# EAGLE schematic Speed Reg (EAGLE 5.11)

## Sheet 1 of 11
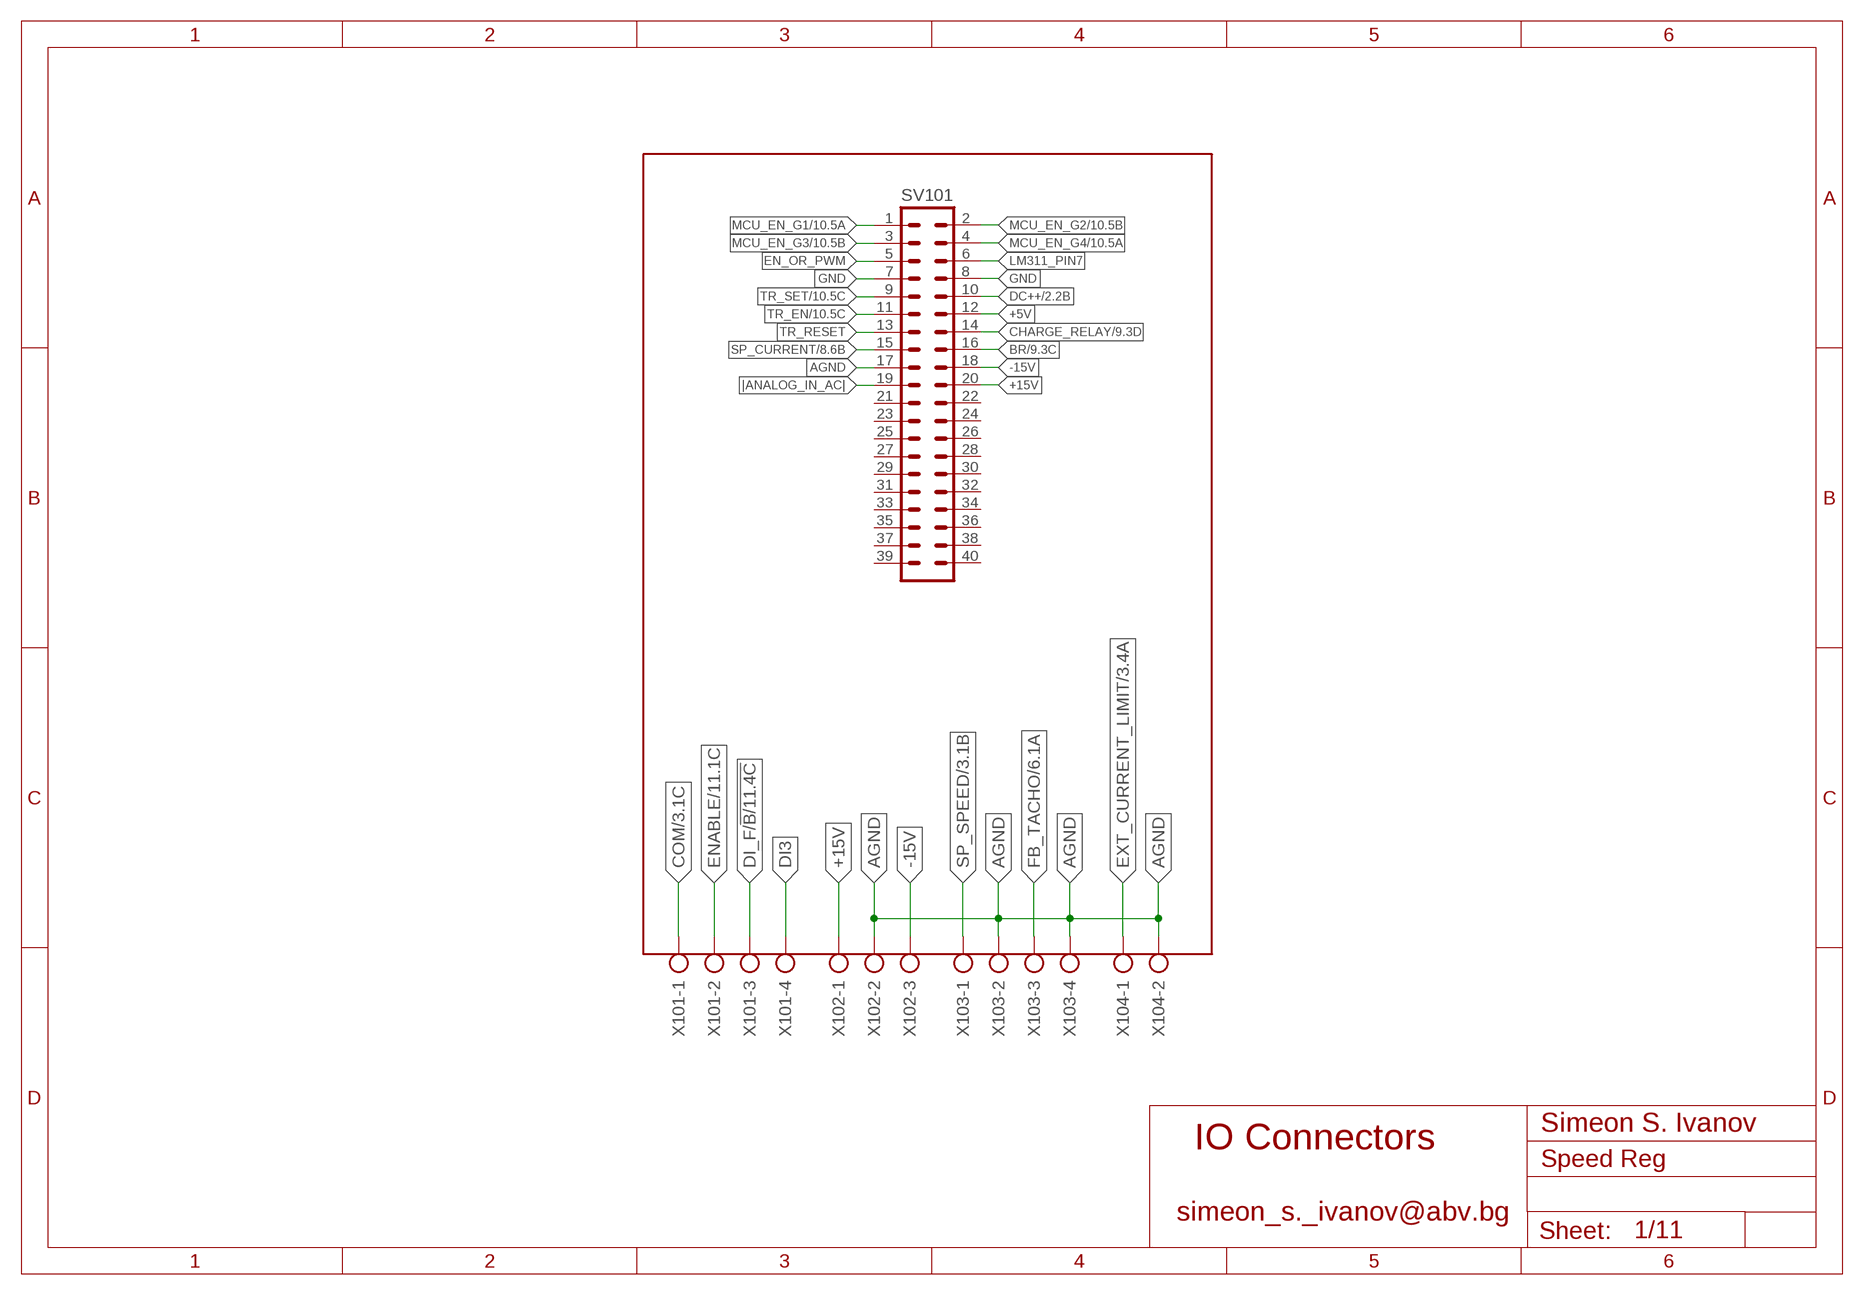
[diagram p0: schematic, sheet 1]

### Parts
SV101  ML40  [ML40]
X101  AK500/4-H  [AK500/4-H]
X102  AK500/3-H  [AK500/3-H]
X103  AK500/4-H  [AK500/4-H]
X104  AK500/2-H  [AK500/2-H]

### Nets
+5V: SV101.12 ; also sheet 2,9,10
+15V: SV101.20 X102.1 ; also sheet 2,3,4,5,6,7,8,9
-15V: SV101.18 X102.3 ; also sheet 2,3,4,5,6,7,8,9
AGND: SV101.17 X102.2 X103.2 X103.4 X104.2 ; also sheet 2,3,4,5,6,7,8,9
BR: SV101.16 ; also sheet 9
CHARGE_RELAY: SV101.14 ; also sheet 9,11
COM: X101.1 ; also sheet 3,11
DC++: SV101.10 ; also sheet 2,9
DI3: X101.4
DI_F/!B: X101.3 ; also sheet 11
EN_OR_PWM: SV101.5
ENABLE: X101.2 ; also sheet 11
EXT_CURRENT_LIMIT: X104.1 ; also sheet 3
FB_TACHO: X103.3 ; also sheet 6
GND: SV101.7 SV101.8 ; also sheet 2,9,10,11
LM311_PIN7: SV101.6
MCU_EN_G1: SV101.1 ; also sheet 10
MCU_EN_G2: SV101.2 ; also sheet 10
MCU_EN_G3: SV101.3 ; also sheet 10
MCU_EN_G4: SV101.4 ; also sheet 10
SP_CURRENT: SV101.15 ; also sheet 8
SP_SPEED: X103.1 ; also sheet 3
TR_EN: SV101.11 ; also sheet 10
TR_RESET: SV101.13
TR_SET: SV101.9 ; also sheet 10
|ANALOG_IN_AC|: SV101.19
Unconnected: SV101.21 SV101.22 SV101.23 SV101.24 SV101.25 SV101.26 SV101.27 SV101.28 SV101.29 SV101.30 SV101.31 SV101.32 SV101.33 SV101.34 SV101.35 SV101.36 SV101.37 SV101.38 SV101.39 SV101.40

### Notes on the sheet
- Simeon S. Ivanov
- IO Connectors
- simeon_s._ivanov@abv.bg

## Sheet 2 of 11
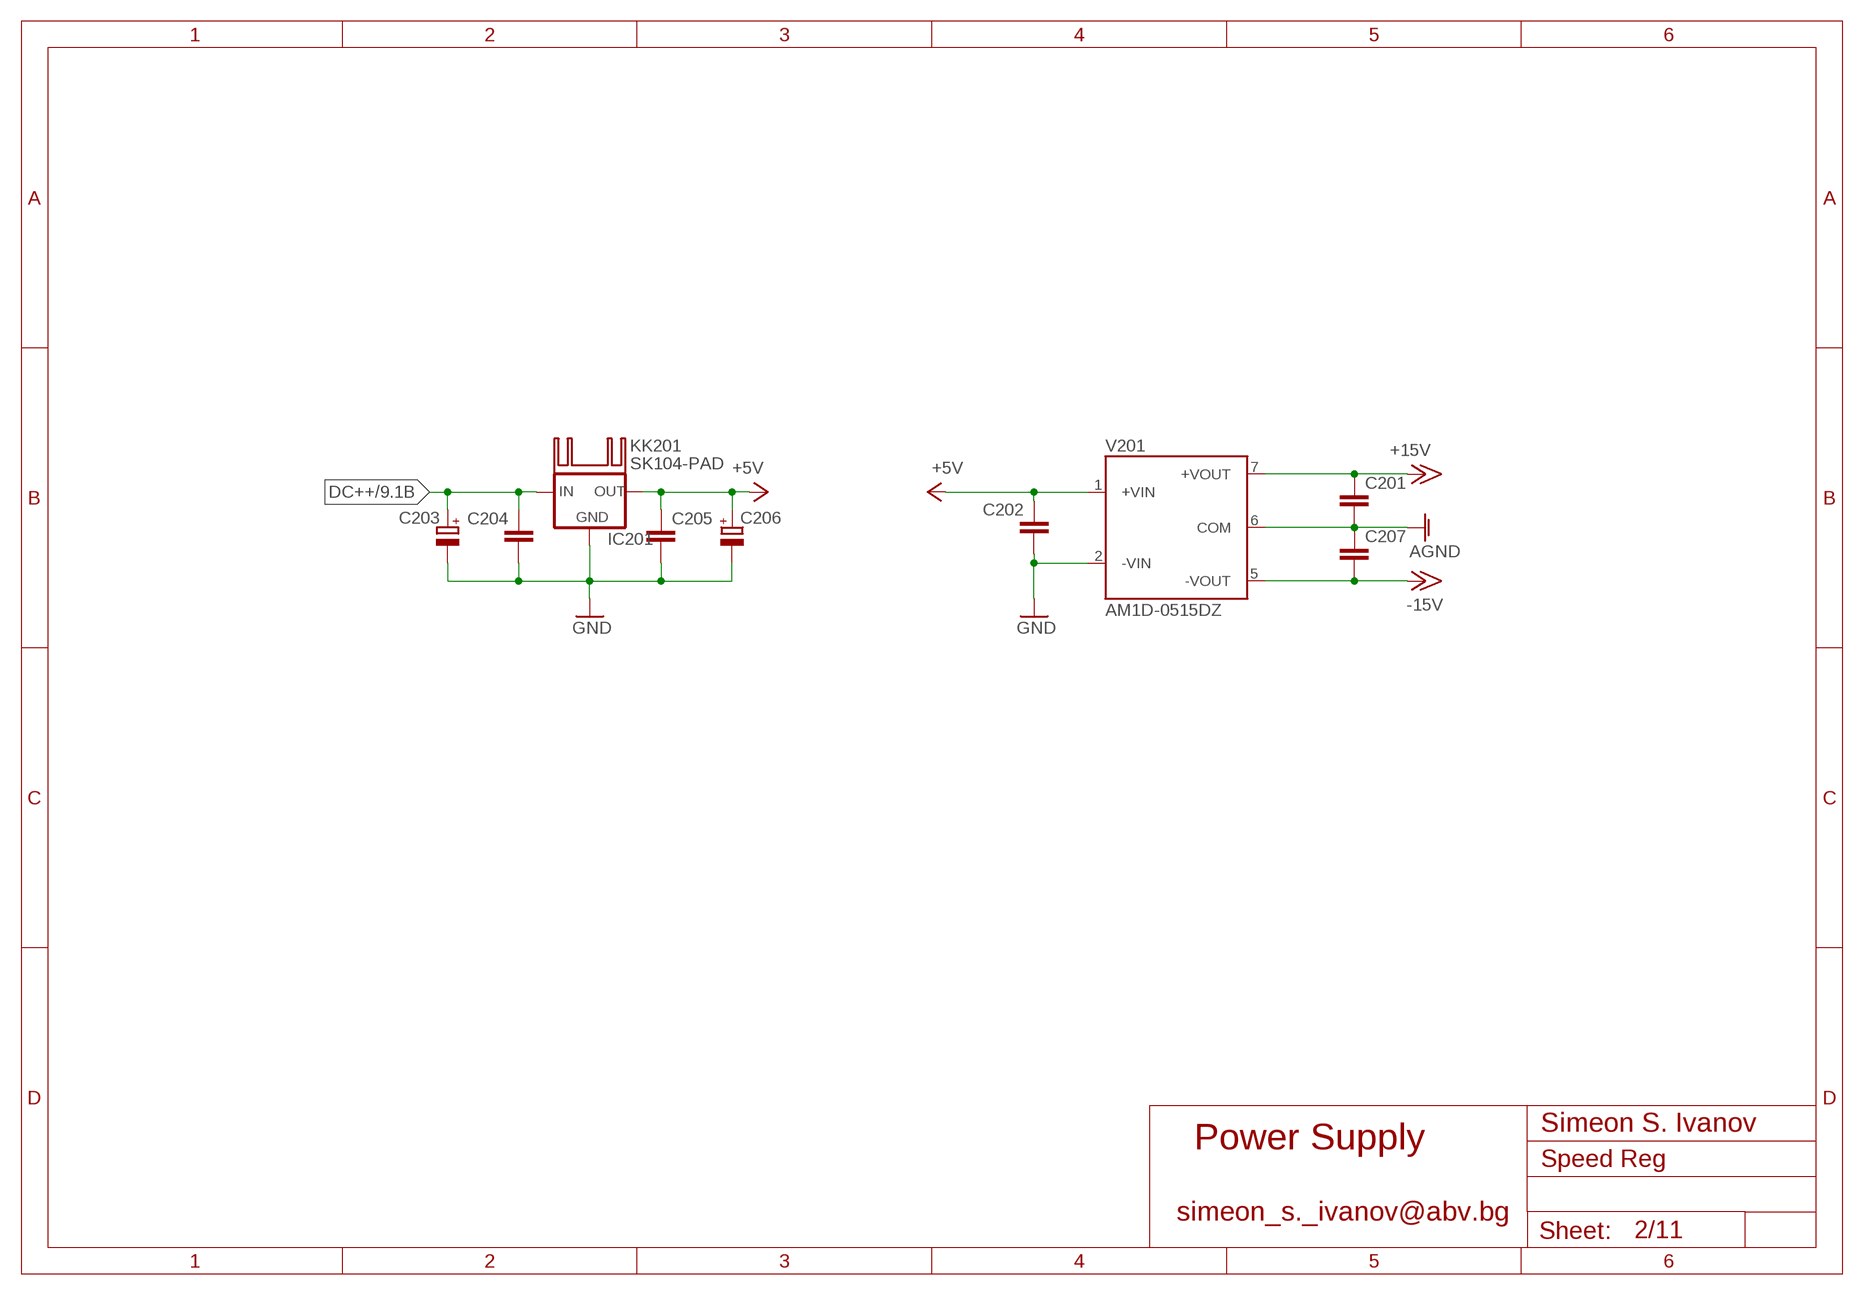
[diagram p1: schematic, sheet 2]

### Parts
C201  C-EUC1206  [C1206]
C202  C-EUC1206  [C1206]
C203  CPOL-EUE2.5-6  [E2,5-6]
C204  C-EUC1206  [C1206]
C205  C-EUC1206  [C1206]
C206  CPOL-EUE2.5-6  [E2,5-6]
C207  C-EUC1206  [C1206]
IC201  78XXS  [78XXS]
KK201  SK104-PAD  [SK104-PAD]
V201  AM1D-0515DZ  TMA0515D  [TMA_DUAL]

### Nets
+5V: C202.1 C205.1 C206.+ IC201.OUT V201.1(+VIN) ; also sheet 1,9,10
+15V: C201.1 V201.7(+VOUT) ; also sheet 1,3,4,5,6,7,8,9
-15V: C207.2 V201.5(-VOUT) ; also sheet 1,3,4,5,6,7,8,9
AGND: C201.2 C207.1 V201.6(COM) ; also sheet 1,3,4,5,6,7,8,9
DC++: C203.+ C204.1 IC201.IN ; also sheet 1,9
GND: C202.2 C203.- C204.2 C205.2 C206.- IC201.GND V201.2(-VIN) ; also sheet 1,9,10,11
Unconnected: KK201.K1(K) KK201.K2(K)

### Notes on the sheet
- Simeon S. Ivanov
- Power Supply
- simeon_s._ivanov@abv.bg

## Sheet 3 of 11
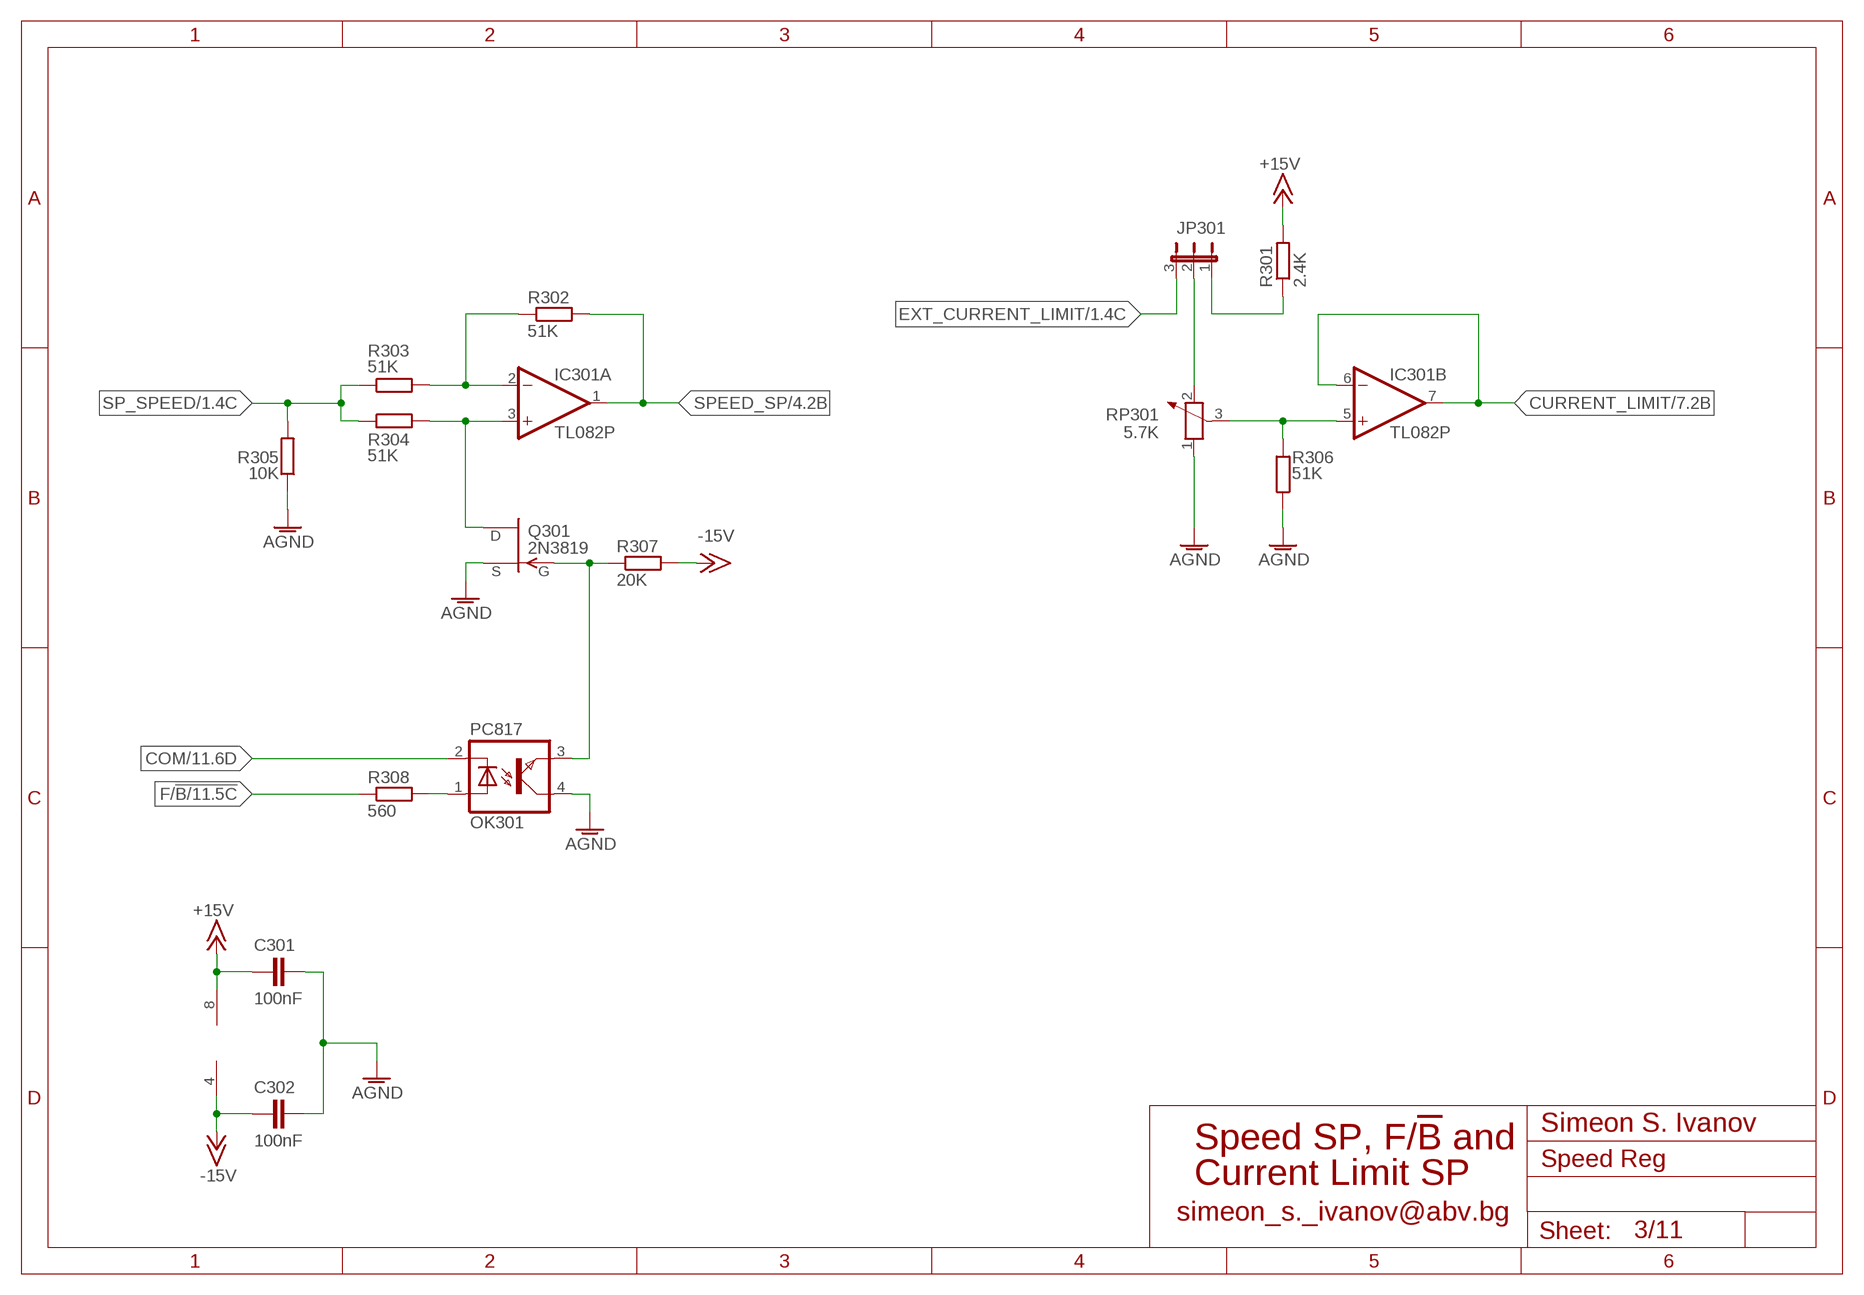
[diagram p2: schematic, sheet 3]

### Parts
C301  100nF  C-EUC0805  [C0805]
C302  100nF  C-EUC0805  [C0805]
IC301  TL082P  [DIL08]
JP301  JP2E  [JP2]
OK301  PC817  [DIL04]
Q301  2N3819  [TO92]
R301  2.4K  R-EU_0207/7  [0207/7]
R302  51K  R-EU_0207/7  [0207/7]
R303  51K  R-EU_0207/7  [0207/7]
R304  51K  R-EU_0207/7  [0207/7]
R305  10K  R-EU_0207/7  [0207/7]
R306  51K  R-EU_0207/7  [0207/7]
R307  20K  R-EU_0207/7  [0207/7]
R308  560  R-EU_0207/7  [0207/7]
RP301  5.7K  POTENTIOMETER_PT-10  [PT-10]

### Nets
+15V: C301.1 IC301.8(P:V+) R301.2 ; also sheet 1,2,4,5,6,7,8,9
-15V: C302.1 IC301.4(P:V-) R307.2 ; also sheet 1,2,4,5,6,7,8,9
AGND: C301.2 C302.2 OK301.4(COL) Q301.3(S) R305.1 R306.1 RP301.1 ; also sheet 1,2,4,5,6,7,8,9
COM: OK301.2(C) ; also sheet 1,11
CURRENT_LIMIT: IC301.6(B:-IN) IC301.7(B:OUT) ; also sheet 7
EXT_CURRENT_LIMIT: JP301.3 ; also sheet 1
F/!B: R308.1 ; also sheet 11
N$10: JP301.2 RP301.2
N$14: OK301.3(EMIT) Q301.2(G) R307.1
N$24: JP301.1 R301.1
N$26: IC301.2(A:-IN) R302.1 R303.2
N$46: IC301.5(B:+IN) R306.2 RP301.3
N$47: OK301.1(A) R308.2
N$49: IC301.3(A:+IN) Q301.1(D) R304.2
SP_SPEED: R303.1 R304.1 R305.2 ; also sheet 1
SPEED_SP: IC301.1(A:OUT) R302.2 ; also sheet 4

### Notes on the sheet
- Simeon S. Ivanov
- Speed SP, F/!B! and
- Current Limit SP
- simeon_s._ivanov@abv.bg

## Sheet 4 of 11
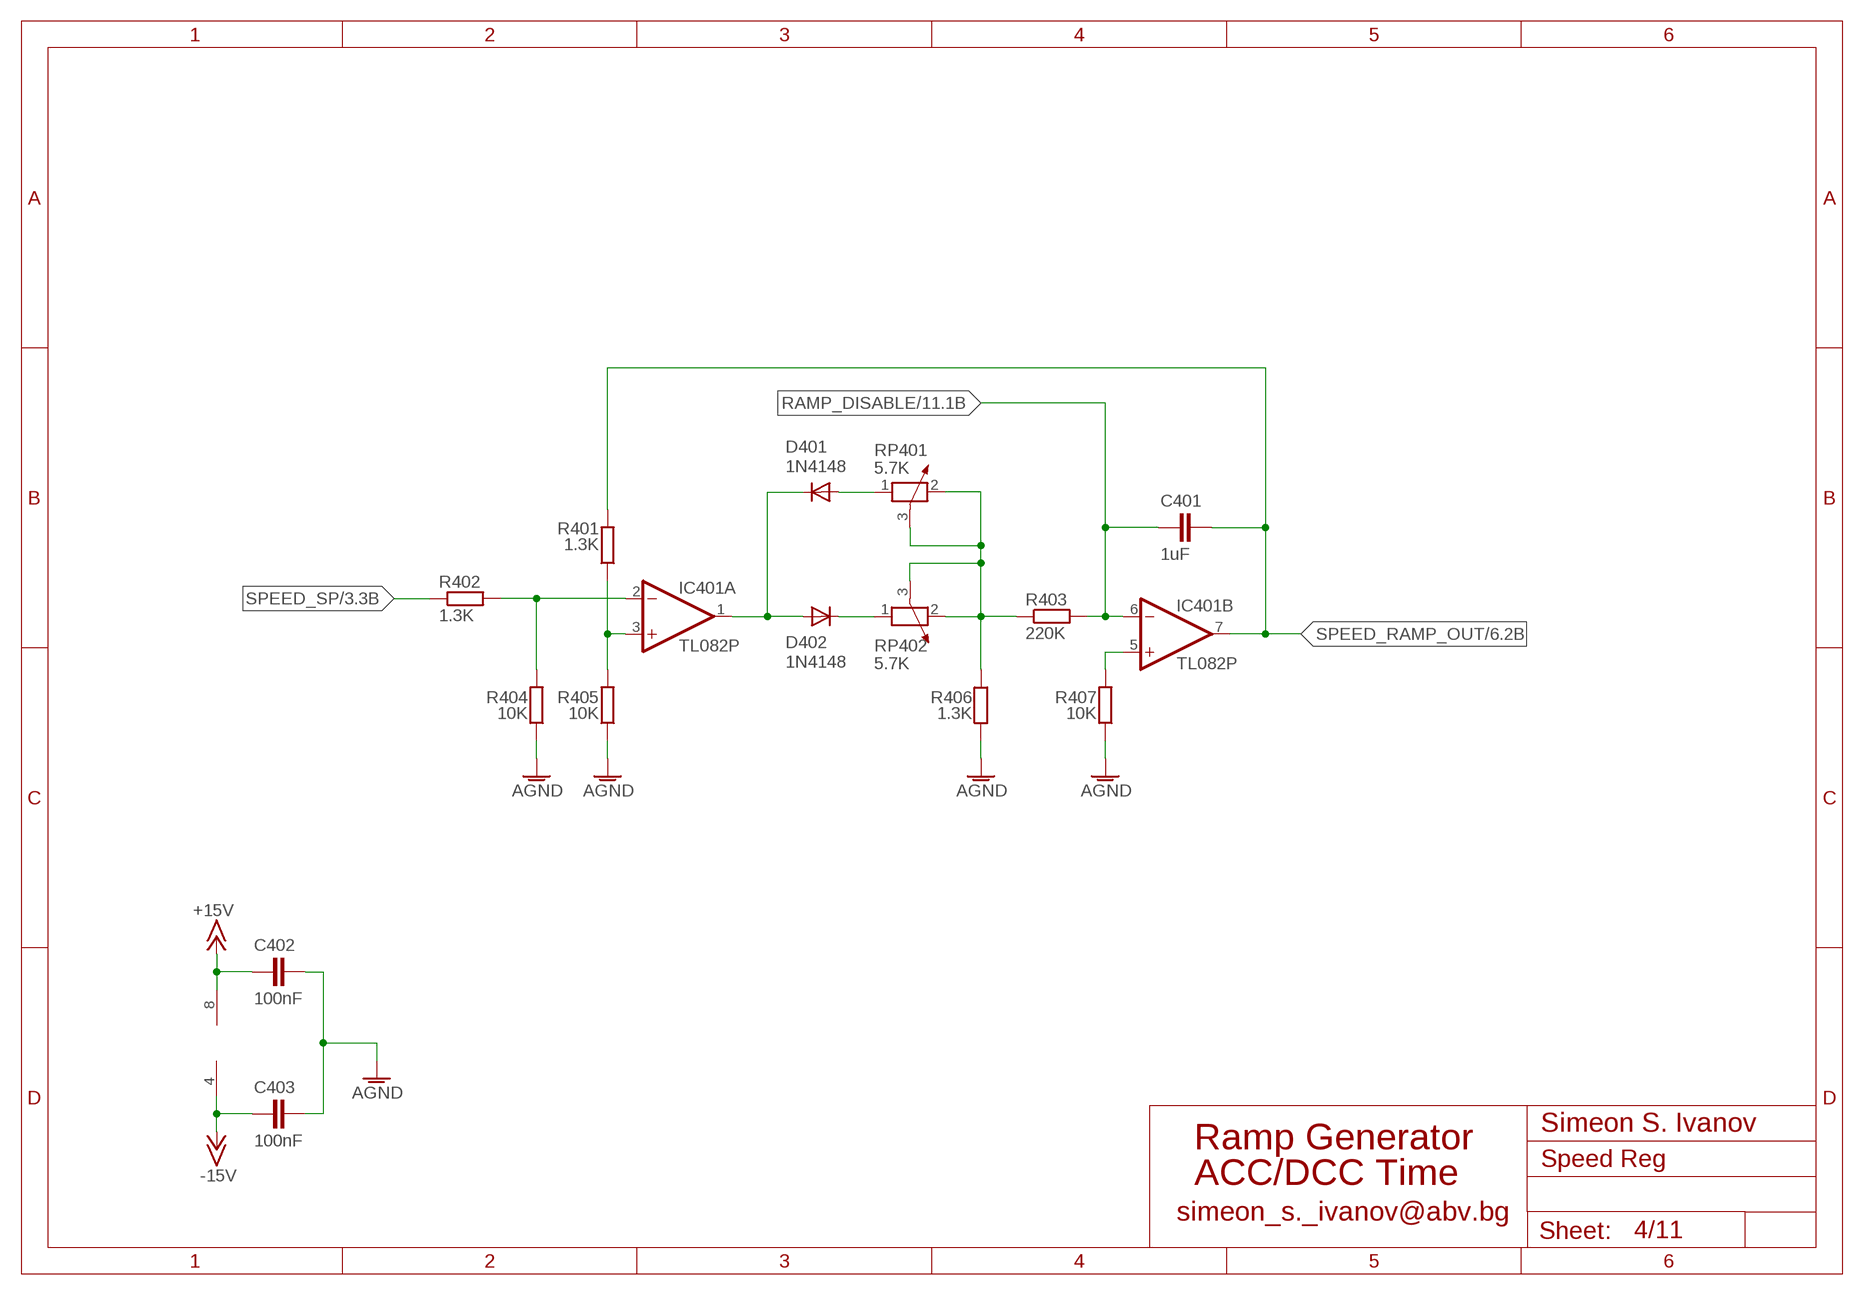
[diagram p3: schematic, sheet 4]

### Parts
C401  1uF  C-EU075-052X106  [C075-052X106]
C402  100nF  C-EUC0805  [C0805]
C403  100nF  C-EUC0805  [C0805]
D401  1N4148  1N4148DO35-10  [DO35-10]
D402  1N4148  1N4148DO35-10  [DO35-10]
IC401  TL082P  [DIL08]
R401  1.3K  R-EU_0207/7  [0207/7]
R402  1.3K  R-EU_0207/7  [0207/7]
R403  220K  R-EU_0207/7  [0207/7]
R404  10K  R-EU_0207/7  [0207/7]
R405  10K  R-EU_0207/7  [0207/7]
R406  1.3K  R-EU_0207/7  [0207/7]
R407  10K  R-EU_M0805  [M0805]
RP401  5.7K  POTENTIOMETER_PT-10  [PT-10]
RP402  5.7K  POTENTIOMETER_PT-10  [PT-10]

### Nets
+15V: C402.1 IC401.8(P:V+) ; also sheet 1,2,3,5,6,7,8,9
-15V: C403.1 IC401.4(P:V-) ; also sheet 1,2,3,5,6,7,8,9
AGND: C402.2 C403.2 R404.1 R405.1 R406.1 R407.1 ; also sheet 1,2,3,5,6,7,8,9
N$6: R403.1 R406.2 RP401.2 RP401.3 RP402.2 RP402.3
N$7: D402.C RP402.1
N$8: D401.A RP401.1
N$9: D401.C D402.A IC401.1(A:OUT)
N$11: IC401.3(A:+IN) R401.1 R405.2
N$12: IC401.2(A:-IN) R402.2 R404.2
N$151: IC401.5(B:+IN) R407.2
RAMP_DISABLE: C401.1 IC401.6(B:-IN) R403.2 ; also sheet 11
SPEED_RAMP_OUT: C401.2 IC401.7(B:OUT) R401.2 ; also sheet 6,11
SPEED_SP: R402.1 ; also sheet 3

### Notes on the sheet
- Simeon S. Ivanov
- Ramp Generator
- ACC/DCC Time
- simeon_s._ivanov@abv.bg

## Sheet 5 of 11
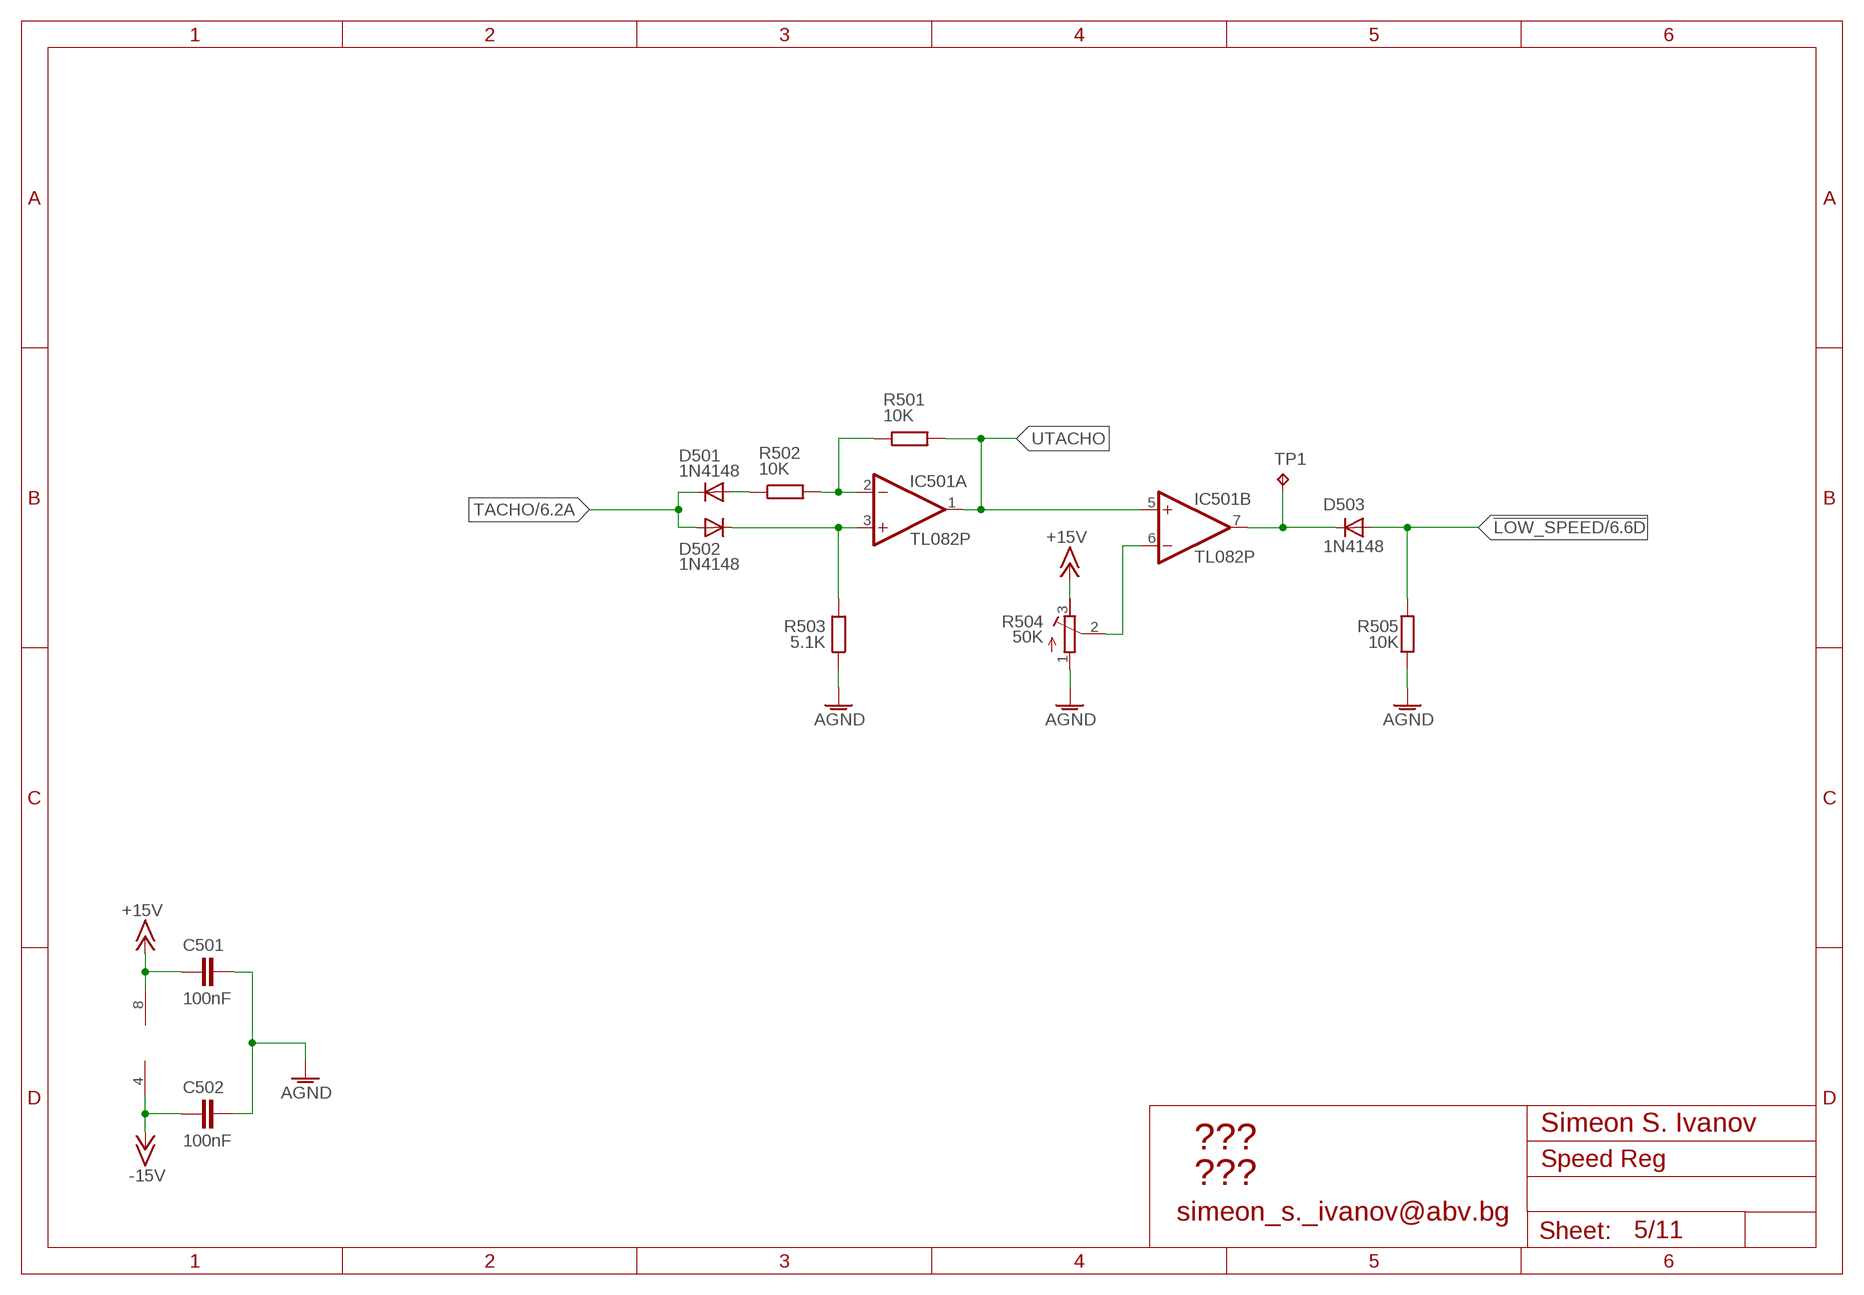
[diagram p4: schematic, sheet 5]

### Parts
C501  100nF  C-EUC0805  [C0805]
C502  100nF  C-EUC0805  [C0805]
D501  1N4148  1N4148DO35-7  [DO35-7]
D502  1N4148  1N4148DO35-7  [DO35-7]
D503  1N4148  1N4148DO35-7  [DO35-7]
IC501  TL082P  [DIL08]
R501  10K  R-EU_0207/7  [0207/7]
R502  10K  R-EU_0207/7  [0207/7]
R503  5.1K  R-EU_0207/7  [0207/7]
R504  50K  R-TRIMM3296W  [RTRIM3296W]
R505  10K  R-EU_0207/7  [0207/7]
TP1  TPPAD1-13  [P1-13]

### Nets
!LOW_SPEED: D503.A R505.2 ; also sheet 6
+15V: C501.1 IC501.8(P:V+) R504.3(A) ; also sheet 1,2,3,4,6,7,8,9
-15V: C502.1 IC501.4(P:V-) ; also sheet 1,2,3,4,6,7,8,9
AGND: C501.2 C502.2 R503.1 R504.1(E) R505.1 ; also sheet 1,2,3,4,6,7,8,9
N$27: D503.C IC501.7(B:OUT) TP1.TP
N$184: IC501.2(A:-IN) R501.1 R502.2
N$241: D502.C IC501.3(A:+IN) R503.2
N$243: D501.A R502.1
N$249: IC501.6(B:-IN) R504.2(S)
TACHO: D501.C D502.A ; also sheet 6
UTACHO: IC501.1(A:OUT) IC501.5(B:+IN) R501.2

### Notes on the sheet
- Simeon S. Ivanov
- ???
- ???
- simeon_s._ivanov@abv.bg

## Sheet 6 of 11
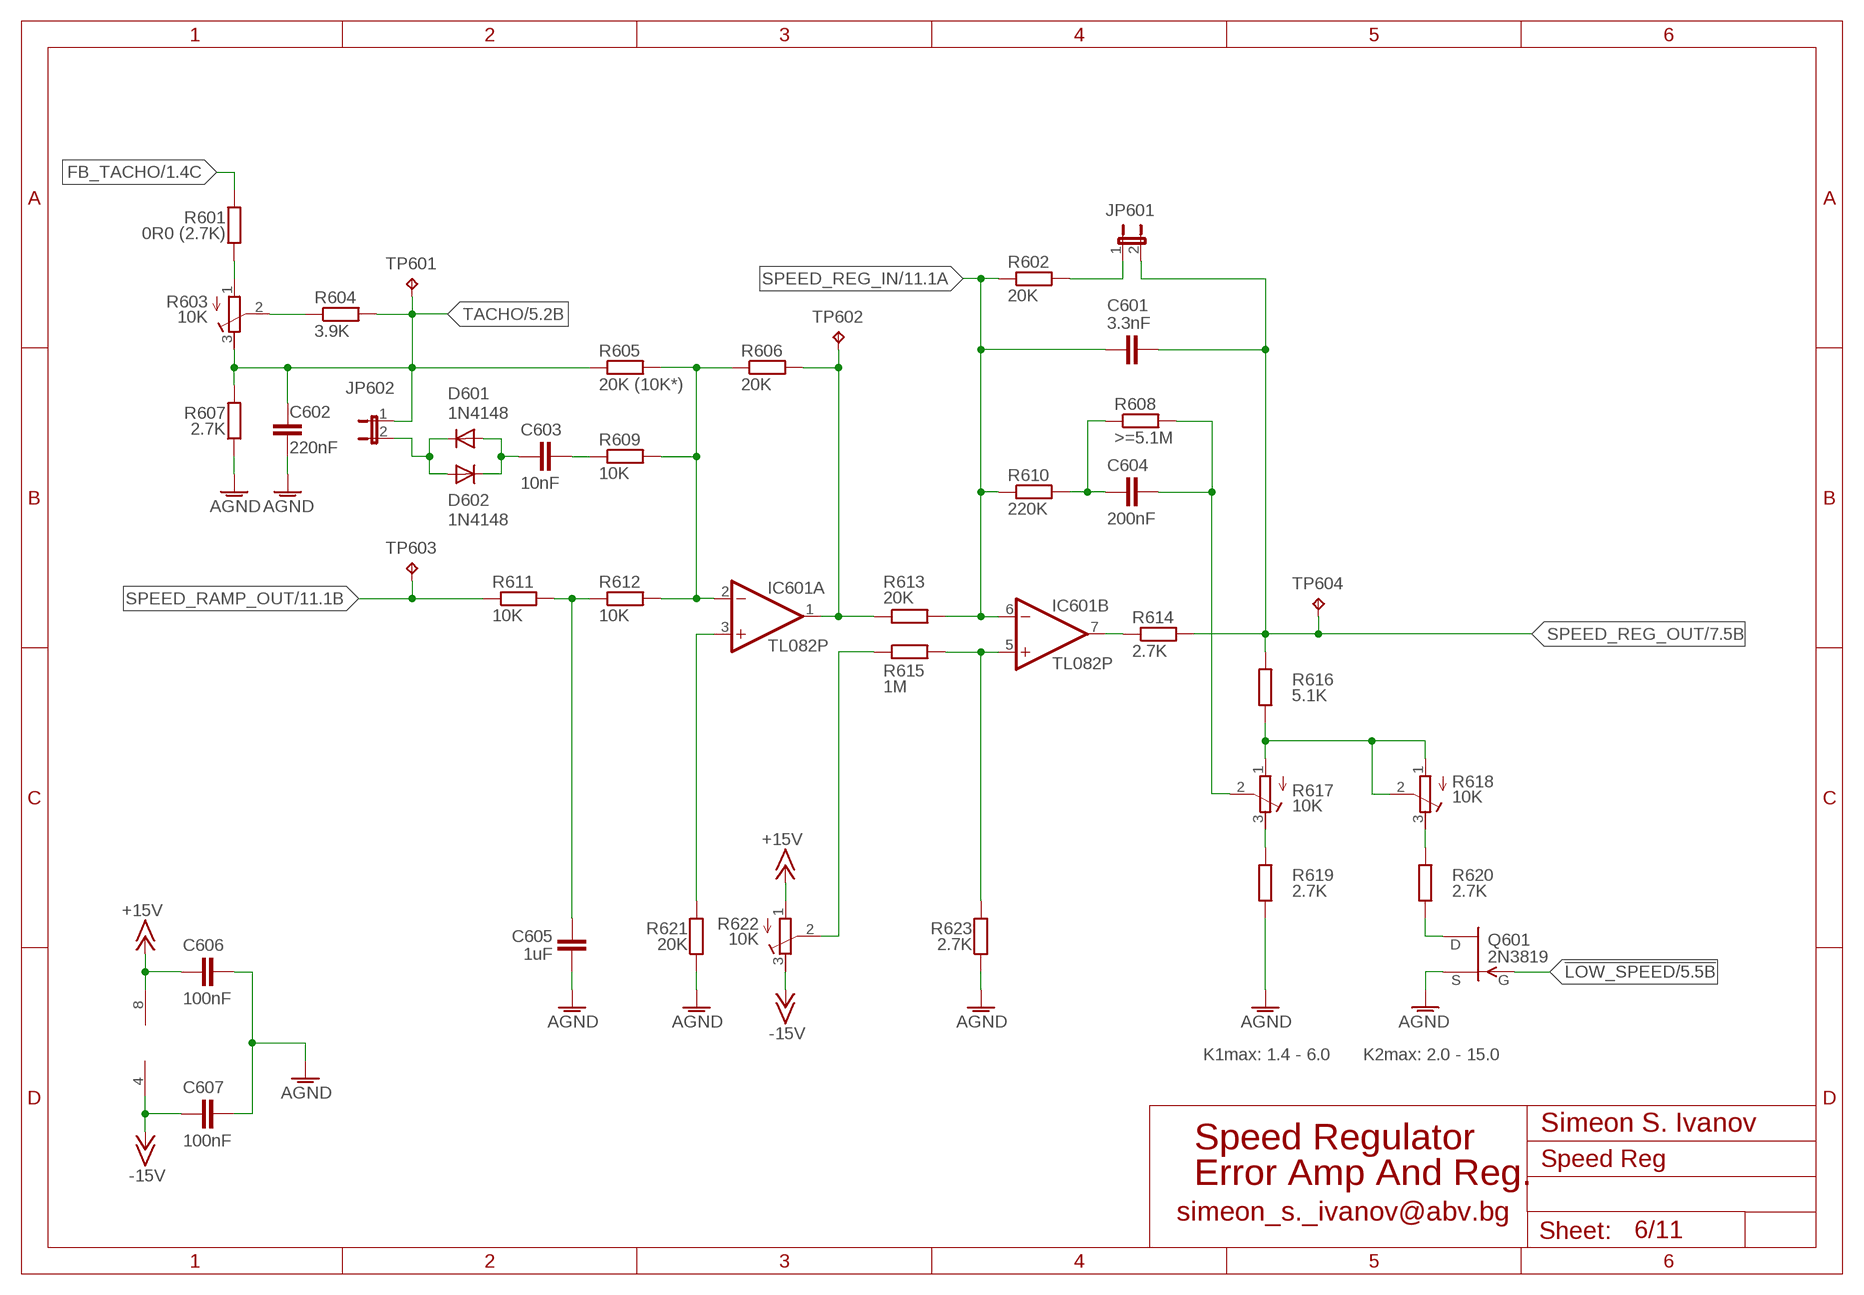
[diagram p5: schematic, sheet 6]

### Parts
C601  3.3nF  C-EU050-024X044  [C050-024X044]
C602  220nF  C-EU075-032X103  [C075-032X103]
C603  10nF  C-EU075-032X103  [C075-032X103]
C604  200nF  C-EU075-052X106  [C075-052X106]
C605  1uF  C-EU075-052X106  [C075-052X106]
C606  100nF  C-EUC0805  [C0805]
C607  100nF  C-EUC0805  [C0805]
D601  1N4148  1N4148DO35-7  [DO35-7]
D602  1N4148  1N4148DO35-7  [DO35-7]
IC601  TL082P  [DIL08]
JP601  JP1E  [JP1]
JP602  JP1E  [JP1]
Q601  2N3819  [TO92]
R601  0R0 (2.7K)  R-EU_0207/7  [0207/7]
R602  20K  R-EU_0207/7  [0207/7]
R603  10K  R-TRIMM3296W  [RTRIM3296W]
R604  3.9K  R-EU_0207/7  [0207/7]
R605  20K (10K*)  R-EU_0207/7  [0207/7]
R606  20K  R-EU_0207/7  [0207/7]
R607  2.7K  R-EU_0207/7  [0207/7]
R608  >=5.1M  R-EU_R1206  [R1206]
R609  10K  R-EU_0207/7  [0207/7]
R610  220K  R-EU_0207/7  [0207/7]
R611  10K  R-EU_0207/7  [0207/7]
R612  10K  R-EU_0207/7  [0207/7]
R613  20K  R-EU_0207/7  [0207/7]
R614  2.7K  R-EU_0207/7  [0207/7]
R615  1M  R-EU_0207/7  [0207/7]
R616  5.1K  R-EU_0207/7  [0207/7]
R617  10K  R-TRIMM3296W  [RTRIM3296W]
R618  10K  R-TRIMM3296W  [RTRIM3296W]
R619  2.7K  R-EU_0207/7  [0207/7]
R620  2.7K  R-EU_0207/7  [0207/7]
R621  20K  R-EU_R0805  [R0805]
R622  10K  R-TRIMM3296W  [RTRIM3296W]
R623  2.7K  R-EU_R0805  [R0805]
TP601  TPPAD1-13  [P1-13]
TP602  TPPAD1-13  [P1-13]
TP603  TPPAD1-13  [P1-13]
TP604  TPPAD1-13  [P1-13]

### Nets
!LOW_SPEED: Q601.2(G) ; also sheet 5
+15V: C606.1 IC601.8(P:V+) R622.1(E) ; also sheet 1,2,3,4,5,7,8,9
-15V: C607.1 IC601.4(P:V-) R622.3(A) ; also sheet 1,2,3,4,5,7,8,9
AGND: C602.1 C605.1 C606.2 C607.2 Q601.3(S) R607.1 R619.1 R621.1 R623.1 ; also sheet 1,2,3,4,5,7,8,9
ERR_AMP_IN_MIN: IC601.2(A:-IN) R605.2 R606.1 R609.2 R612.2
ERROR_OUT: IC601.1(A:OUT) R606.2 R613.1 TP602.TP
FB_TACHO: R601.2 ; also sheet 1
N$13: R615.1 R622.2(S)
N$15: C605.2 R611.2 R612.1
N$17: R601.1 R603.1(E)
N$19: C604.1 R608.1 R610.2
N$20: R616.1 R617.1(E) R618.1(E) R618.2(S)
N$21: JP601.1 R602.2
N$22: R617.3(A) R619.2
N$23: C603.2 R609.1
N$25: C603.1 D601.A D602.C
N$28: D601.C D602.A JP602.2
N$58: R603.2(S) R604.1
N$106: IC601.3(A:+IN) R621.2
N$150: IC601.5(B:+IN) R615.2 R623.2
N$183: IC601.7(B:OUT) R614.1
N$242: R618.3(A) R620.2
N$245: Q601.1(D) R620.1
SPEED_ENABLE_2: C604.2 R608.2 R617.2(S)
SPEED_RAMP_OUT: R611.1 TP603.TP ; also sheet 4,11
SPEED_REG_IN: C601.1 IC601.6(B:-IN) R602.1 R610.1 R613.2 ; also sheet 11
SPEED_REG_OUT: C601.2 JP601.2 R614.2 R616.2 TP604.TP ; also sheet 7,8,9,11
TACHO: C602.2 JP602.1 R603.3(A) R604.2 R605.1 R607.2 TP601.TP ; also sheet 5

### Notes on the sheet
- K1max: 1.4 - 6.0 | K2max: 2.0 - 15.0
- Simeon S. Ivanov
- Speed Regulator
- Error Amp And Reg.
- simeon_s._ivanov@abv.bg

## Sheet 7 of 11
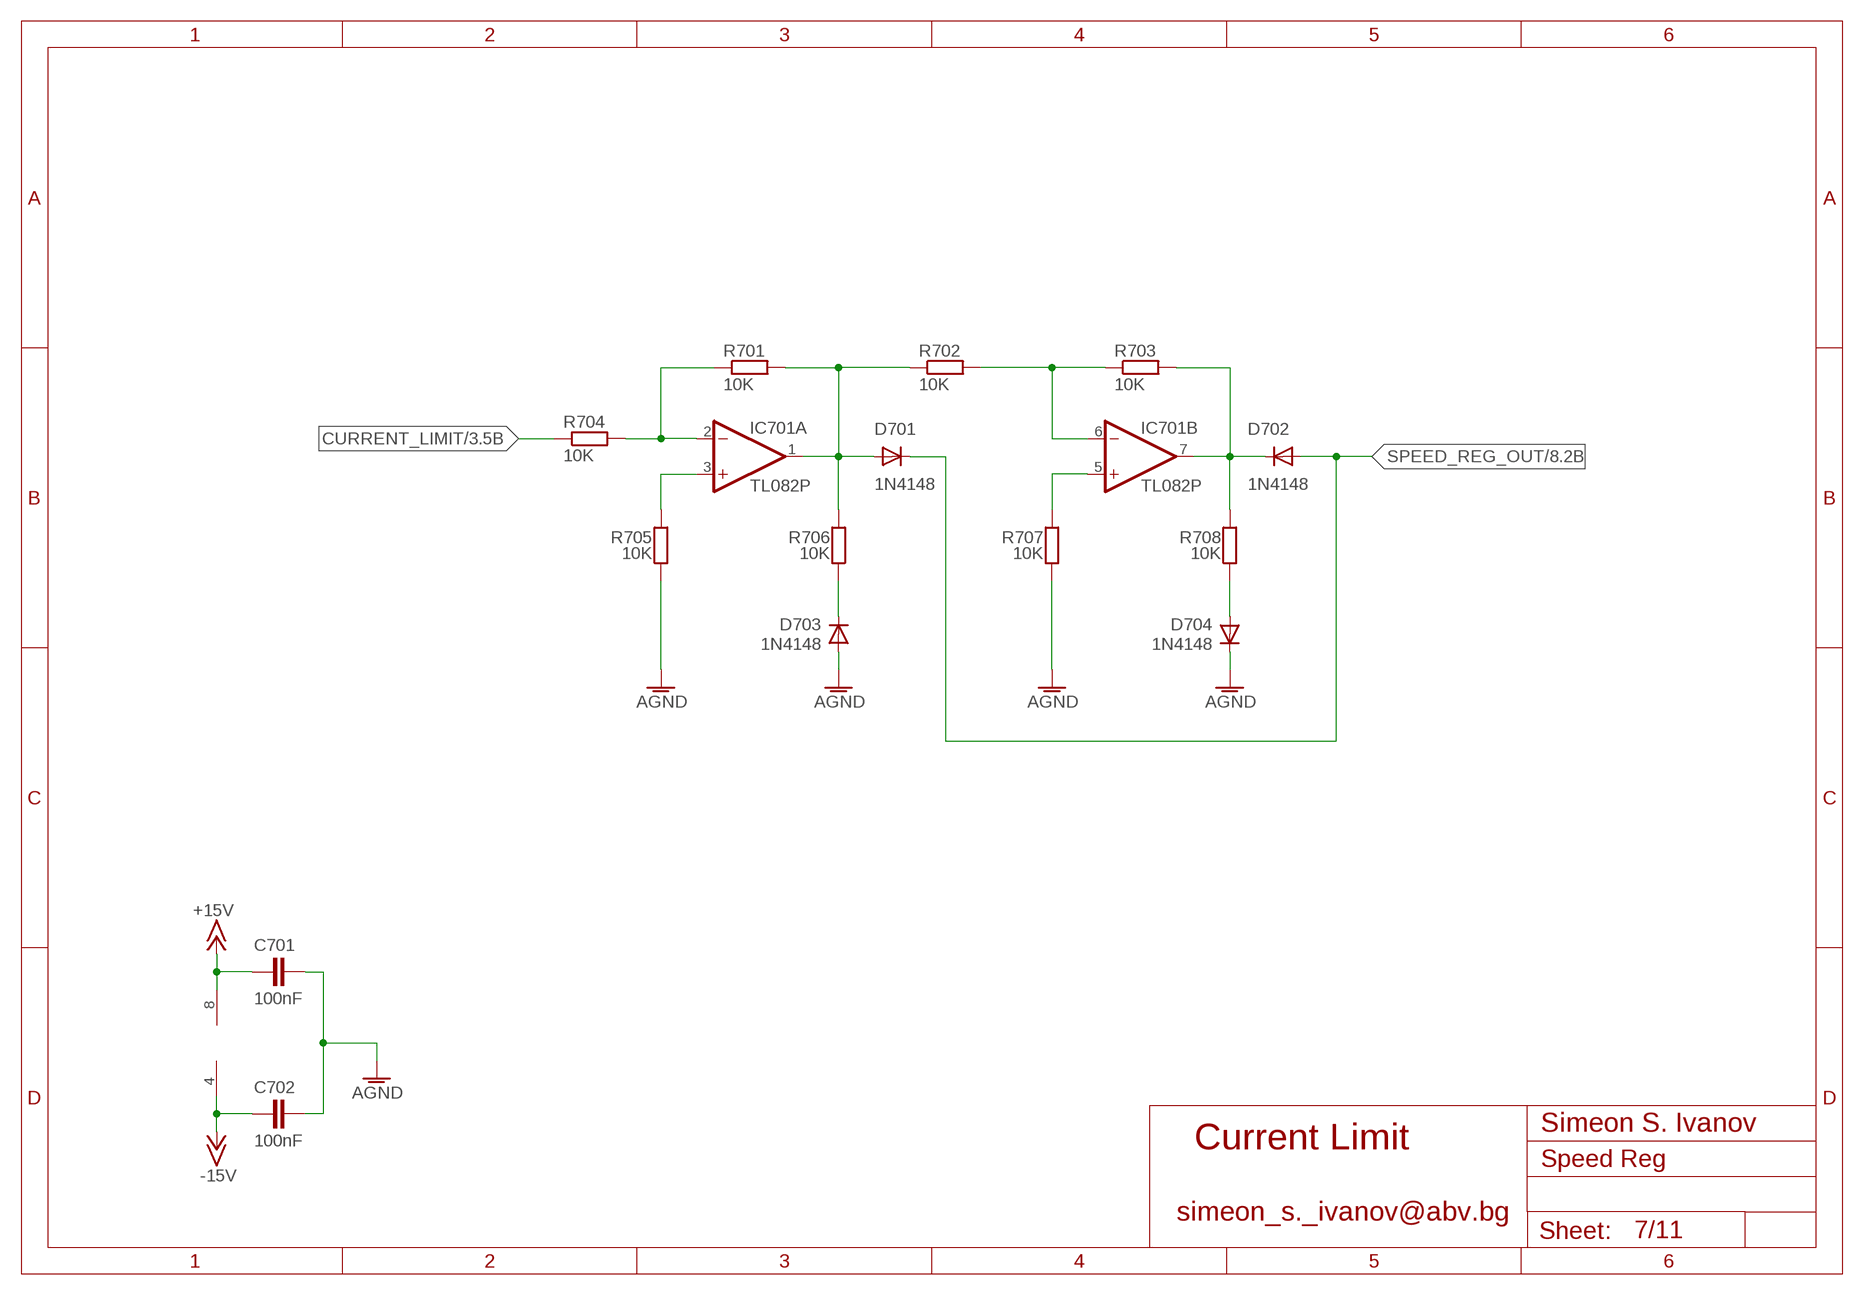
[diagram p6: schematic, sheet 7]

### Parts
C701  100nF  C-EUC0805  [C0805]
C702  100nF  C-EUC0805  [C0805]
D701  1N4148  1N4148DO35-7  [DO35-7]
D702  1N4148  1N4148DO35-7  [DO35-7]
D703  1N4148  1N4148DO35-7  [DO35-7]
D704  1N4148  1N4148DO35-7  [DO35-7]
IC701  TL082P  [DIL08]
R701  10K  R-EU_0207/7  [0207/7]
R702  10K  R-EU_0207/7  [0207/7]
R703  10K  R-EU_0207/7  [0207/7]
R704  10K  R-EU_0207/7  [0207/7]
R705  10K  R-EU_R0805  [R0805]
R706  10K  R-EU_0207/7  [0207/7]
R707  10K  R-EU_R0805  [R0805]
R708  10K  R-EU_0207/7  [0207/7]

### Nets
+15V: C701.1 IC701.8(P:V+) ; also sheet 1,2,3,4,5,6,8,9
-15V: C702.1 IC701.4(P:V-) ; also sheet 1,2,3,4,5,6,8,9
AGND: C701.2 C702.2 D703.A D704.C R705.1 R707.1 ; also sheet 1,2,3,4,5,6,8,9
CURRENT_LIMIT: R704.1 ; also sheet 3
N$51: IC701.2(A:-IN) R701.1 R704.2
N$53: D701.A IC701.1(A:OUT) R701.2 R702.1 R706.2
N$54: IC701.6(B:-IN) R702.2 R703.1
N$55: D702.C IC701.7(B:OUT) R703.2 R708.2
N$57: IC701.5(B:+IN) R707.2
N$61: IC701.3(A:+IN) R705.2
N$105: D703.C R706.1
N$121: D704.A R708.1
SPEED_REG_OUT: D701.C D702.A ; also sheet 6,8,9,11

### Notes on the sheet
- Simeon S. Ivanov
- Current Limit
- simeon_s._ivanov@abv.bg

## Sheet 8 of 11
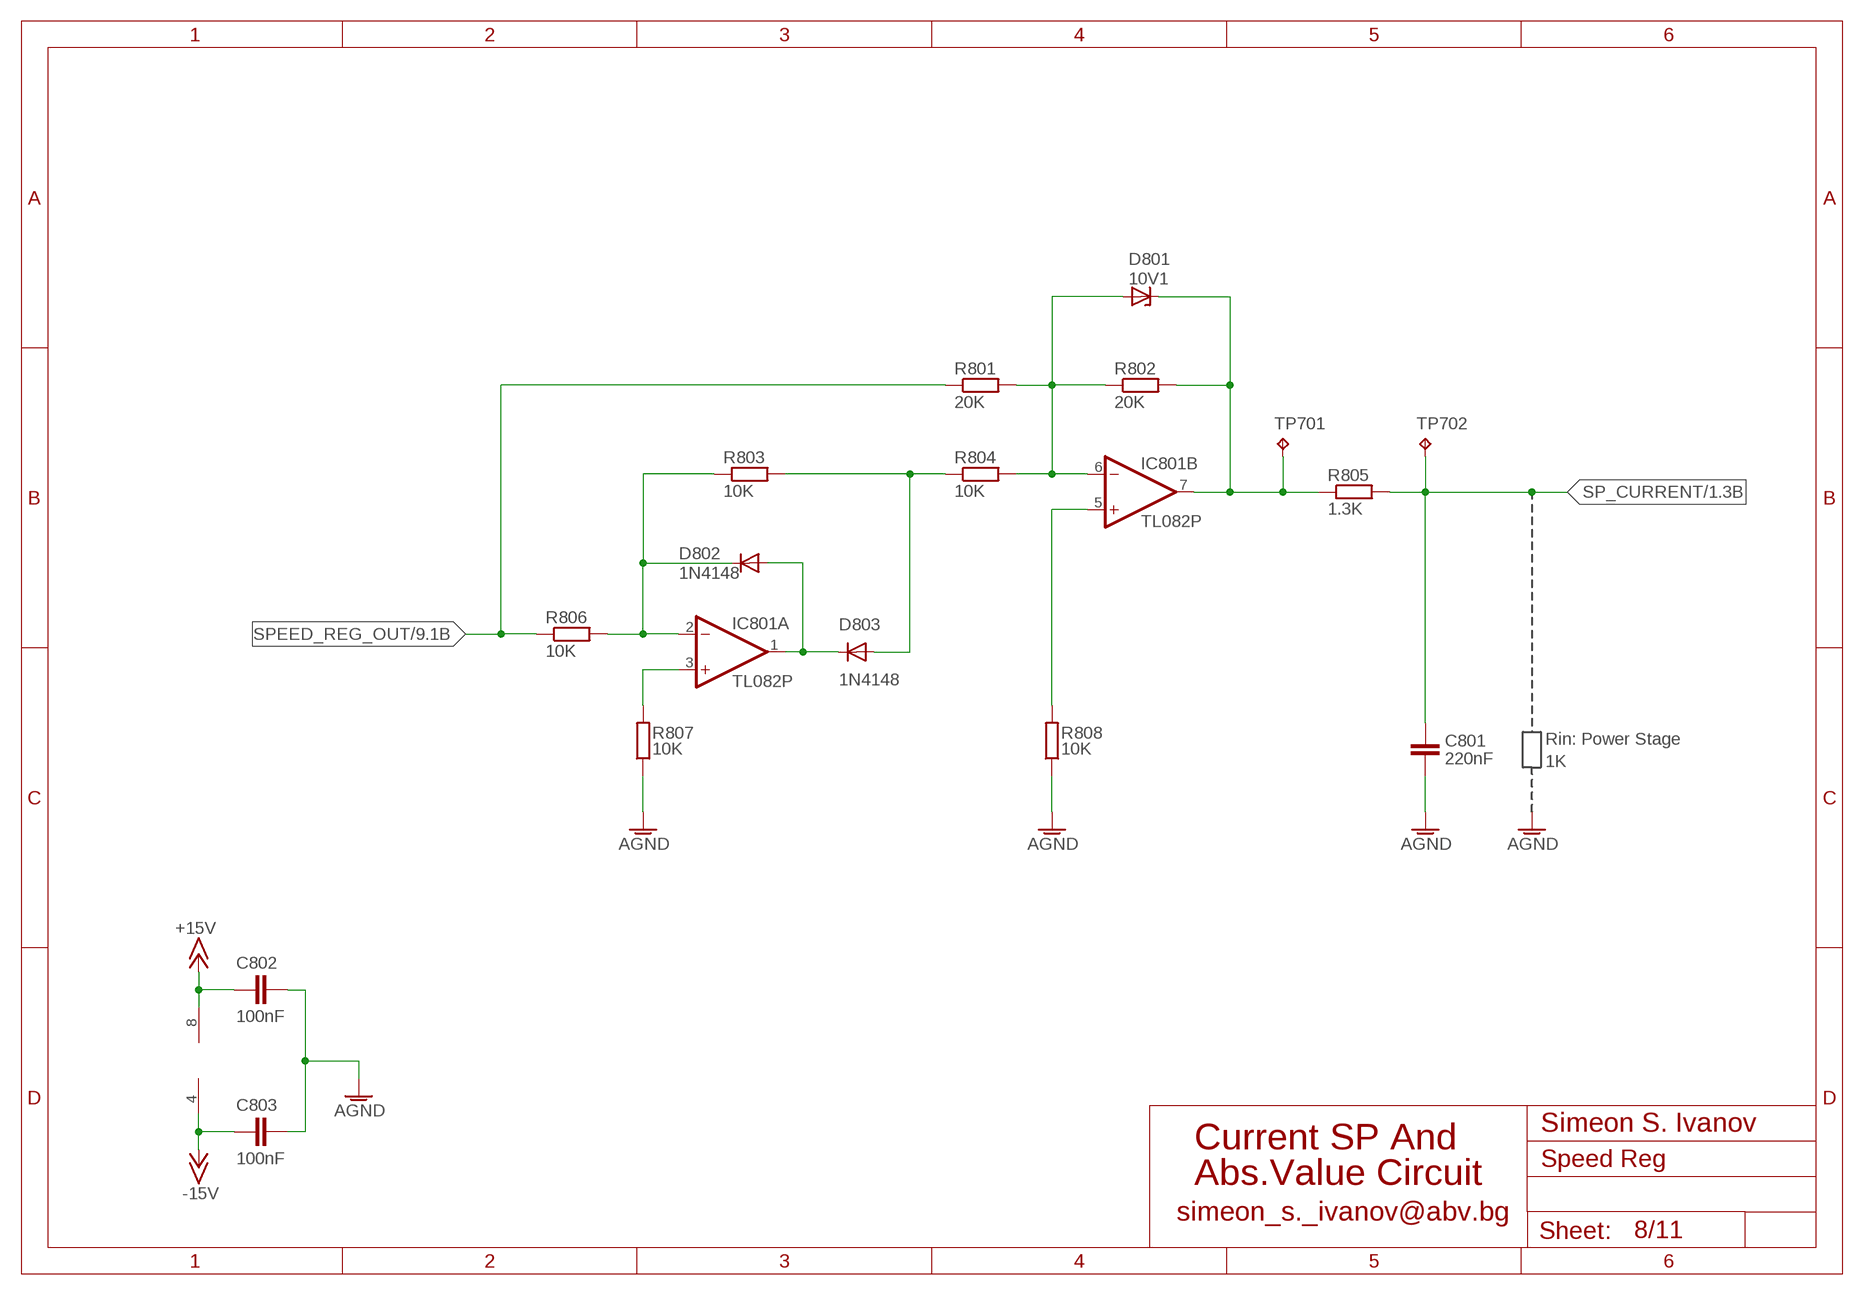
[diagram p7: schematic, sheet 8]

### Parts
C801  220nF  C-EU075-032X103  [C075-032X103]
C802  100nF  C-EUC0805  [C0805]
C803  100nF  C-EUC0805  [C0805]
D801  10V1  ZENER-DIODEZD-5  [ZDIO-5]
D802  1N4148  1N4148DO35-7  [DO35-7]
D803  1N4148  1N4148DO35-7  [DO35-7]
IC801  TL082P  [DIL08]
R801  20K  R-EU_0207/7  [0207/7]
R802  20K  R-EU_0207/7  [0207/7]
R803  10K  R-EU_0207/7  [0207/7]
R804  10K  R-EU_0207/7  [0207/7]
R805  1.3K  R-EU_0207/7  [0207/7]
R806  10K  R-EU_0207/7  [0207/7]
R807  10K  R-EU_R0805  [R0805]
R808  10K  R-EU_R0805  [R0805]
TP701  TPPAD1-13  [P1-13]
TP702  TPPAD1-13  [P1-13]

### Nets
+15V: C802.1 IC801.8(P:V+) ; also sheet 1,2,3,4,5,6,7,9
-15V: C803.1 IC801.4(P:V-) ; also sheet 1,2,3,4,5,6,7,9
AGND: C801.2 C802.2 C803.2 R807.1 R808.1 ; also sheet 1,2,3,4,5,6,7,9
N$30: D802.A D803.C IC801.1(A:OUT)
N$31: D802.C IC801.2(A:-IN) R803.1 R806.2
N$32: D803.A R803.2 R804.1
N$33: D801.A IC801.6(B:-IN) R801.2 R802.1 R804.2
N$178: IC801.3(A:+IN) R807.2
N$179: IC801.5(B:+IN) R808.2
SP_CURRENT: C801.1 R805.2 TP702.TP ; also sheet 1
SP_CURRENT_TO_RC: D801.C IC801.7(B:OUT) R802.2 R805.1 TP701.TP
SPEED_REG_OUT: R801.1 R806.1 ; also sheet 6,7,9,11

### Notes on the sheet
- Rin: Power Stage
- 1K
- Simeon S. Ivanov
- Current SP And
- Abs.Value Circuit
- simeon_s._ivanov@abv.bg

## Sheet 9 of 11
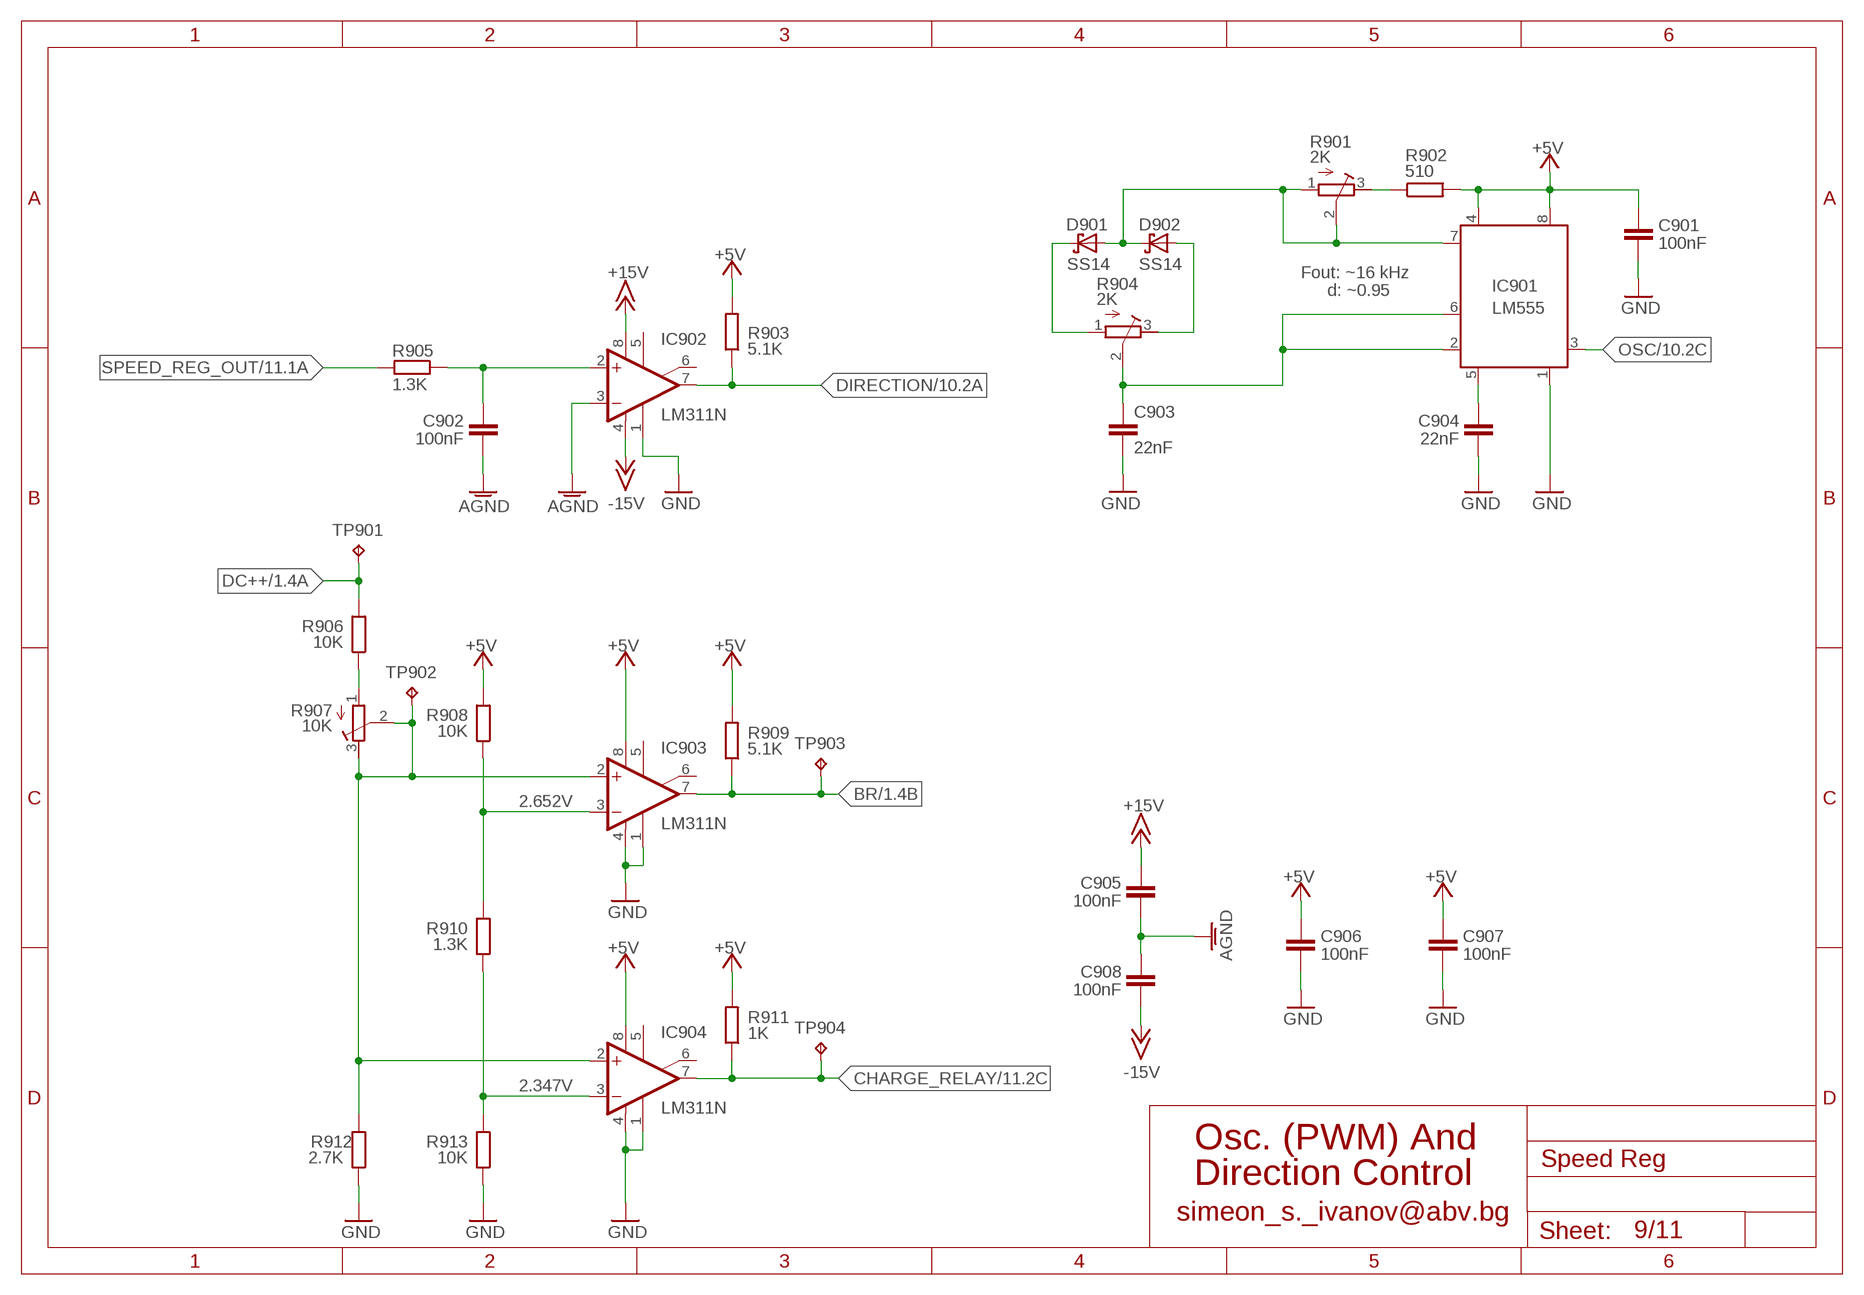
[diagram p8: schematic, sheet 9]

### Parts
C901  100nF  C-EUC0805  [C0805]
C902  100nF  C-EU075-032X103  [C075-032X103]
C903  22nF  C-EU050-024X044  [C050-024X044]
C904  22nF  C-EU050-024X044  [C050-024X044]
C905  100nF  C-EUC0805  [C0805]
C906  100nF  C-EUC0805  [C0805]
C907  100nF  C-EUC0805  [C0805]
C908  100nF  C-EUC0805  [C0805]
D901  SS14  SCHOTTKY-DIODESMD  [SMB]
D902  SS14  SCHOTTKY-DIODESMD  [SMB]
IC901  LM555  20  [DIL8-HOME]
IC902  LM311N  [DIL08]
IC903  LM311N  [DIL08]
IC904  LM311N  [DIL08]
R901  2K  R-TRIMM3296W  [RTRIM3296W]
R902  510  R-EU_0204/7  [0204/7]
R903  5.1K  R-EU_0204/7  [0204/7]
R904  2K  R-TRIMM3296W  [RTRIM3296W]
R905  1.3K  R-EU_0204/7  [0204/7]
R906  10K  R-EU_0207/10  [0207/10]
R907  10K  R-TRIMM3296W  [RTRIM3296W]
R908  10K  R-EU_0204/7  [0204/7]
R909  5.1K  R-EU_0204/7  [0204/7]
R910  1.3K  R-EU_0204/7  [0204/7]
R911  1K  R-EU_0204/7  [0204/7]
R912  2.7K  R-EU_0204/7  [0204/7]
R913  10K  R-EU_0204/7  [0204/7]
TP901  TPPAD1-13  [P1-13]
TP902  TPPAD1-13  [P1-13]
TP903  TPPAD1-13  [P1-13]
TP904  TPPAD1-13  [P1-13]

### Nets
2.347V: IC904.3(-IN) R910.1 R913.2
2.652V: IC903.3(-IN) R908.1 R910.2
+5V: C901.1 C906.1 C907.1 IC901.4 IC901.8 IC903.8(V+) IC904.8(V+) R902.2 R903.2 R908.2 R909.2 R911.2 ; also sheet 1,2,10
+15V: C905.1 IC902.8(V+) ; also sheet 1,2,3,4,5,6,7,8
-15V: C908.2 IC902.4(V-) ; also sheet 1,2,3,4,5,6,7,8
AGND: C902.2 C905.2 C908.1 IC902.3(-IN) ; also sheet 1,2,3,4,5,6,7,8
BR: IC903.7(OUT) R909.1 TP903.TP ; also sheet 1
CHARGE_RELAY: IC904.7(OUT) R911.1 TP904.TP ; also sheet 1,11
DC++: R906.2 TP901.TP ; also sheet 1,2
DIRECTION: IC902.7(OUT) R903.1 ; also sheet 10
GND: C901.2 C903.2 C904.2 C906.2 C907.2 IC901.1 IC902.1(GND) IC903.1(GND) IC903.4(V-) IC904.1(GND) IC904.4(V-) R912.1 R913.1 ; also sheet 1,2,10,11
N$34: C904.1 IC901.5
N$35: D901.A D902.C IC901.7 R901.1(E) R901.2(S)
N$36: D901.C R904.1(E)
N$37: D902.A R904.3(A)
N$40: C903.1 IC901.2 IC901.6 R904.2(S)
N$41: R901.3(A) R902.1
N$48: IC903.2(+IN) IC904.2(+IN) R907.2(S) R907.3(A) R912.2 TP902.TP
N$52: R906.1 R907.1(E)
N$97: C902.1 IC902.2(+IN) R905.1
OSC: IC901.3 ; also sheet 10
SPEED_REG_OUT: R905.2 ; also sheet 6,7,8,11
Unconnected: IC902.5(ON) IC902.6(ON/STR) IC903.5(ON) IC903.6(ON/STR) IC904.5(ON) IC904.6(ON/STR)

### Notes on the sheet
- Fout: ~16 kHz
- d: ~0.95
- Osc. (PWM) And
- Direction Control
- simeon_s._ivanov@abv.bg

## Sheet 10 of 11
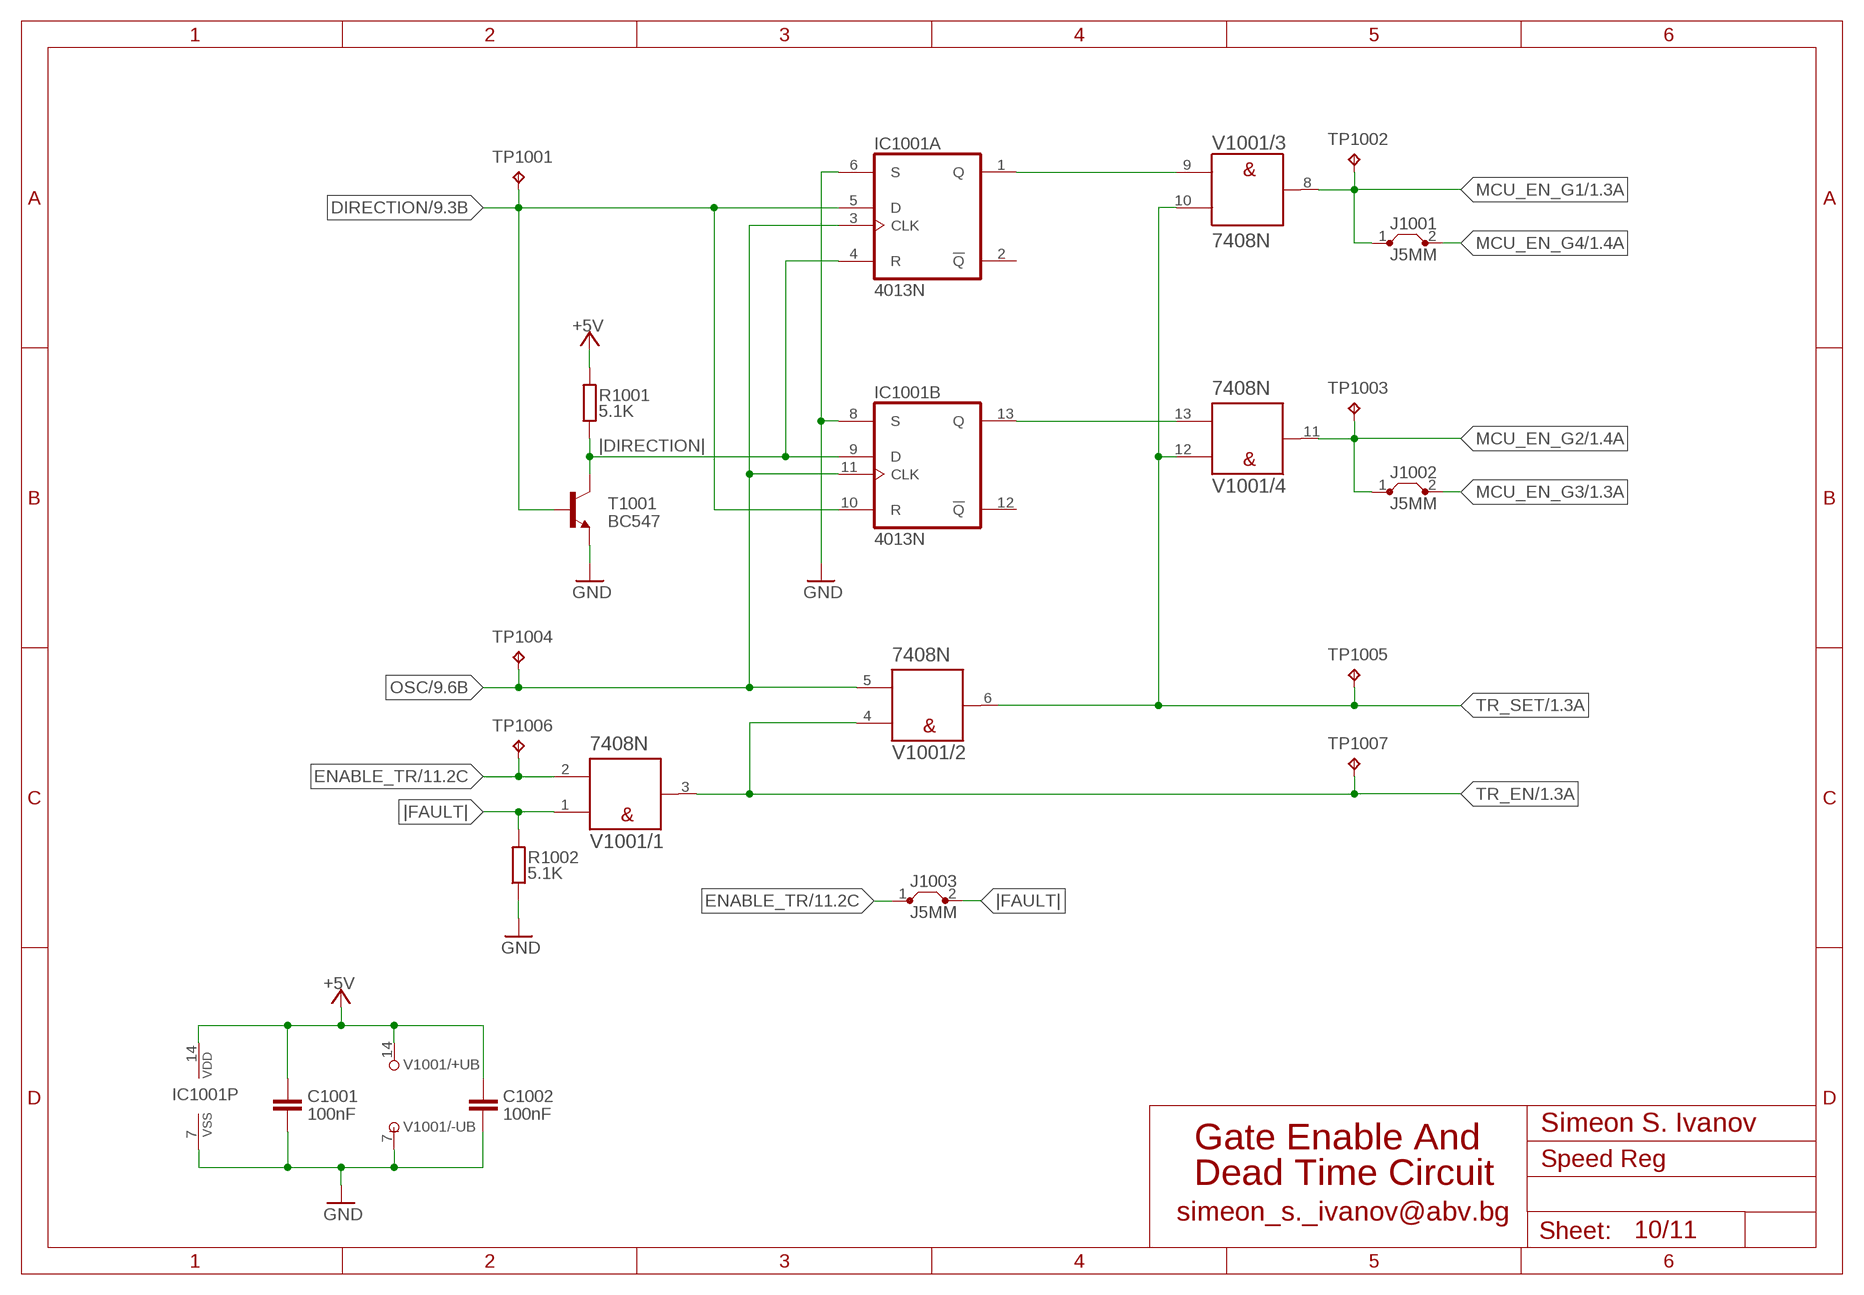
[diagram p9: schematic, sheet 10]

### Parts
C1001  100nF  C-EUC0805  [C0805]
C1002  100nF  C-EUC0805  [C0805]
IC1001  4013N  [DIL14]
J1001  J5MM  [05]
J1002  J5MM  [05]
J1003  J5MM  [05]
R1001  5.1K  R-EU_R0805  [R0805]
R1002  5.1K  R-EU_R0805  [R0805]
T1001  BC547  [TO92]
TP1001  TPPAD1-13  [P1-13]
TP1002  TPPAD1-13  [P1-13]
TP1003  TPPAD1-13  [P1-13]
TP1004  TPPAD1-13  [P1-13]
TP1005  TPPAD1-13  [P1-13]
TP1006  TPPAD1-13  [P1-13]
TP1007  TPPAD1-13  [P1-13]
V1001  7408N  [DIL14]

### Nets
+5V: C1001.1 C1002.1 IC1001.14(P:VDD) R1001.2 V1001.14(/+UB:+UB) ; also sheet 1,2,9
DIRECTION: IC1001.5(A:D) IC1001.10(B:R) T1001.2(B) TP1001.TP ; also sheet 9
ENABLE_TR: J1003.1 TP1006.TP V1001.2(/1:B) ; also sheet 11
GND: C1001.2 C1002.2 IC1001.6(A:S) IC1001.7(P:VSS) IC1001.8(B:S) R1002.1 T1001.1(E) V1001.7(/-UB:-UB) ; also sheet 1,2,9,11
MCU_EN_G1: J1001.1 TP1002.TP V1001.8(/3:Y) ; also sheet 1
MCU_EN_G2: J1002.1 TP1003.TP V1001.11(/4:Y) ; also sheet 1
MCU_EN_G3: J1002.2 ; also sheet 1
MCU_EN_G4: J1001.2 ; also sheet 1
N$250: IC1001.13(B:Q) V1001.13(/4:B)
N$251: IC1001.1(A:Q) V1001.9(/3:A)
OSC: IC1001.3(A:CLK) IC1001.11(B:CLK) TP1004.TP V1001.5(/2:B) ; also sheet 9
TR_EN: TP1007.TP V1001.3(/1:Y) V1001.4(/2:A) ; also sheet 1
TR_SET: TP1005.TP V1001.6(/2:Y) V1001.10(/3:B) V1001.12(/4:A) ; also sheet 1
|DIRECTION|: IC1001.4(A:R) IC1001.9(B:D) R1001.1 T1001.3(C)
|FAULT|: J1003.2 R1002.2 V1001.1(/1:A)
Unconnected: IC1001.2(A:!Q) IC1001.12(B:!Q)

### Notes on the sheet
- Simeon S. Ivanov
- Gate Enable And
- Dead Time Circuit
- simeon_s._ivanov@abv.bg

## Sheet 11 of 11
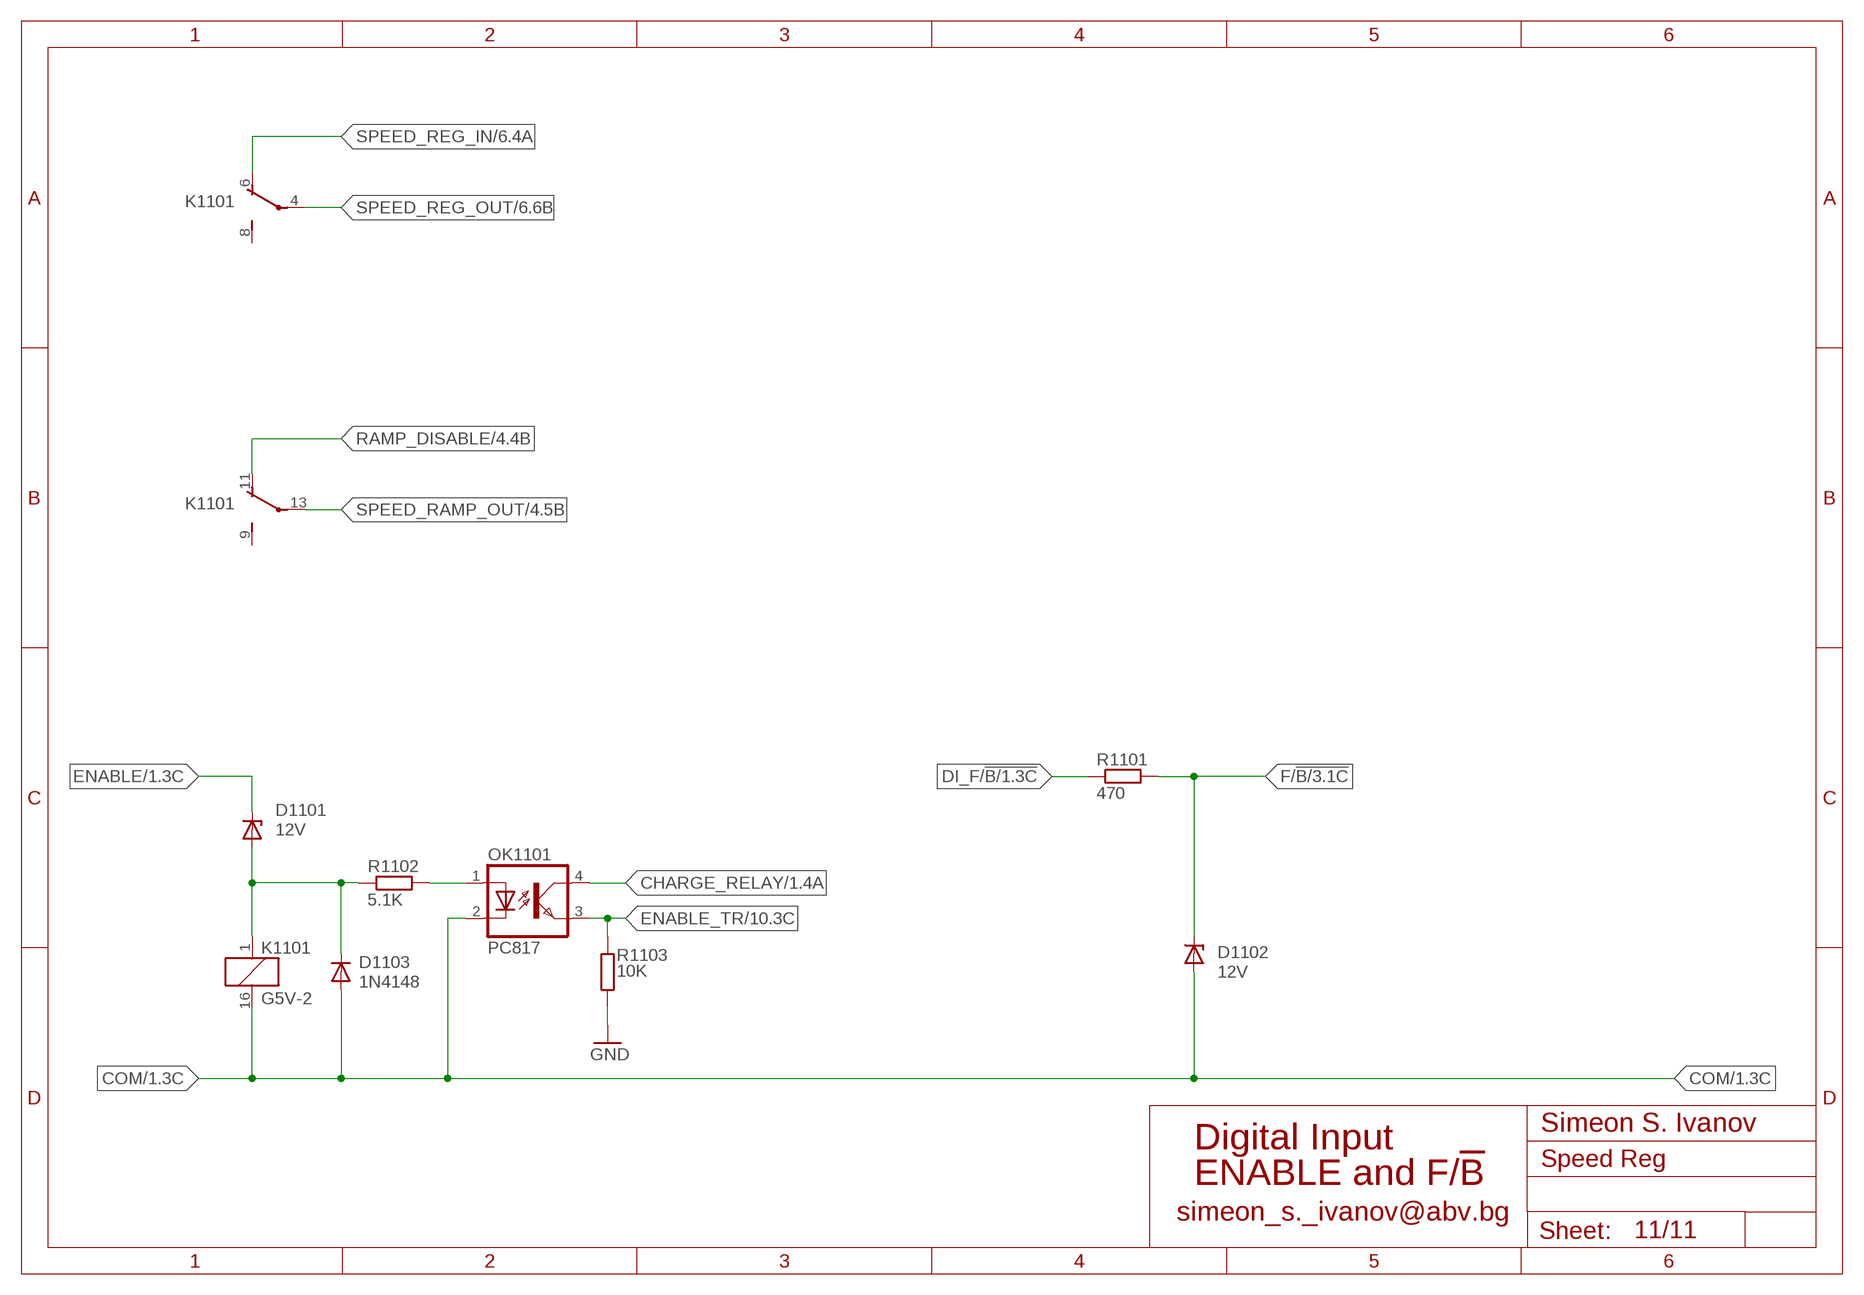
[diagram p10: schematic, sheet 11]

### Parts
D1101  12V  ZENER-DIODEZD-7.5  [ZDIO-7.5]
D1102  12V  ZENER-DIODEZD-7.5  [ZDIO-7.5]
D1103  1N4148  1N4148DO35-7  [DO35-7]
K1101  G5V-2  [G5V-2]
OK1101  PC817  [DIL04]
R1101  470  R-EU_0207/7  [0207/7]
R1102  5.1K  R-EU_0207/7  [0207/7]
R1103  10K  R-EU_0207/7  [0207/7]

### Nets
CHARGE_RELAY: OK1101.4(COL) ; also sheet 1,9
COM: D1102.A D1103.A K1101.16 OK1101.2(C) ; also sheet 1,3
DI_F/!B: R1101.1 ; also sheet 1
ENABLE: D1101.C ; also sheet 1
ENABLE_TR: OK1101.3(EMIT) R1103.2 ; also sheet 10
F/!B: D1102.C R1101.2 ; also sheet 3
GND: R1103.1 ; also sheet 1,2,9,10
N$87: OK1101.1(A) R1102.2
N$88: D1101.A D1103.C K1101.1 R1102.1
RAMP_DISABLE: K1101.11(2:O) ; also sheet 4
SPEED_RAMP_OUT: K1101.13(2:P) ; also sheet 4,6
SPEED_REG_IN: K1101.6(1:O) ; also sheet 6
SPEED_REG_OUT: K1101.4(1:P) ; also sheet 6,7,8,9
Unconnected: K1101.8(1:S) K1101.9(2:S)

### Notes on the sheet
- Simeon S. Ivanov
- Digital Input
- ENABLE and F/!B
- simeon_s._ivanov@abv.bg

## Library data of the parts
C201 C202 C204 C205 C207 C301 C302 C401-C403 C501 C502 C601-C607 C701 C702 C801-C803 C901-C908 C1001 C1002 = rcl:C-EU: CAPACITOR, European symbol
C203 C206 = rcl:CPOL-EU: POLARIZED CAPACITOR, European symbol
D401 D402 D501-D503 D601 D602 D701-D704 D802 D803 D1103 = diode:1N4148: DIODE high speed (Philips)
D801 D1101 D1102 = diode:ZENER-DIODE: Z-Diode
D901 D902 = diode:SCHOTTKY-DIODE: Schottky Diode
IC201 = v-reg:78XXS: VOLTAGE REGULATOR
IC301 IC401 IC501 IC601 IC701 IC801 = linear:TL082: OP AMP
IC901 = 555:2
IC902-IC904 = linear:LM311: COMPARATOR
IC1001 = 40xx:4013: Dual D FLIP FLOP, set/reset
J1001-J1003 = jumper:J: Bridge
JP301 = jumper:JP2E: JUMPER
JP601 JP602 = jumper:JP1E: JUMPER
K1101 = relay:G5V-2: OMRON PCB Relay Source: http://www.omron.com/ecb/products/pdf/en-g5v2.pdf; MPN: G5V-2 5DC; OC_FARNELL: 9949488; OC_NEWARK: 78K5703
KK201 = heatsink:SK104-PAD: HEATSINK manufacturer Fischer/distributor Buerklin
OK301 OK1101 = optocoupler:PC817: SHARP OPTO COUPLER; MPN: PC817X4J000F; OC_FARNELL: 9707727; OC_NEWARK: 97K7059
Q301 Q601 = transistor-fet:2N3819: N-Channel Junction FET
R301-R308 R401-R407 R501-R503 R505 R601 R602 R604-R616 R619-R621 R623 R701-R708 R801-R808 R902 R903 R905 R906 R908-R913 R1001 R1002 R1101-R1103 = rcl:R-EU_: RESISTOR, European symbol
R504 R603 R617 R618 R622 R901 R904 R907 = rcl:R-TRIMM: Trimm resistor
RP301 RP401 RP402 = rcl:POTENTIOMETER_: Potentiometer
SV101 = con-harting-ml:ML40: HARTING; OC_FARNELL: unknown; OC_NEWARK: unknown
T1001 = transistor:BC547: NPN TRANSISTOR
TP1 TP601-TP604 TP701 TP702 TP901-TP904 TP1001-TP1007 = testpad:TP: Test pad
V201 = myTraco-electronic:TMA*?
V1001 = 74ttl-din:74*08: Quad 2-input AND gate
X101 X103 = con-ptr500:AK500/4-H: CONNECTOR Aug. 2004 / PTR Meßtechnik: Die Bezeichnung der Serie AK505 wurde geändert. Es handelt sich hierbei um AK500 in horizontaler Ausführung.; OC_FARNELL: unknown; OC_NEWARK: unknown
X102 = con-ptr500:AK500/3-H: CONNECTOR Aug. 2004 / PTR Meßtechnik: Die Bezeichnung der Serie AK505 wurde geändert. Es handelt sich hierbei um AK500 in horizontaler Ausführung.; OC_FARNELL: unknown; OC_NEWARK: unknown
X104 = con-ptr500:AK500/2-H: CONNECTOR Aug. 2004 / PTR Meßtechnik: Die Bezeichnung der Serie AK505 wurde geändert. Es handelt sich hierbei um AK500 in horizontaler Ausführung.; OC_FARNELL: unknown; OC_NEWARK: unknown